# EasyEDA Pro project ProDoc_Sensor_2025-09-14.epro, board SENSOR_PCB
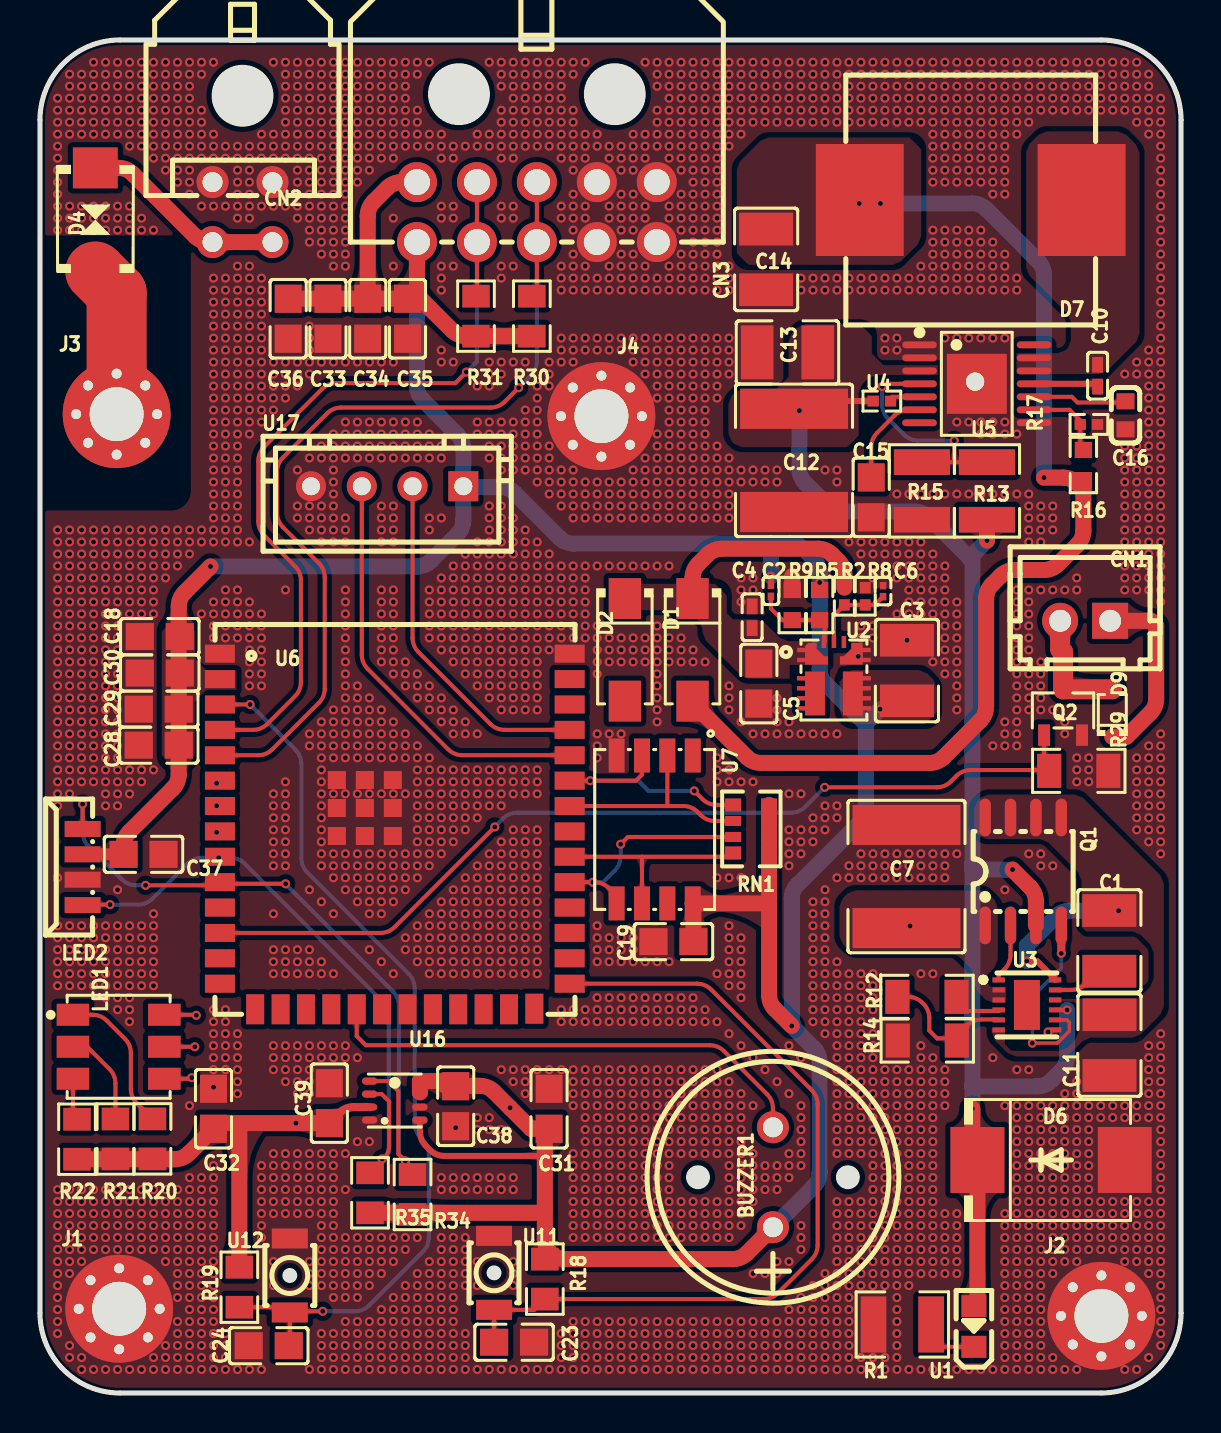
[diagram p1: board, top side]
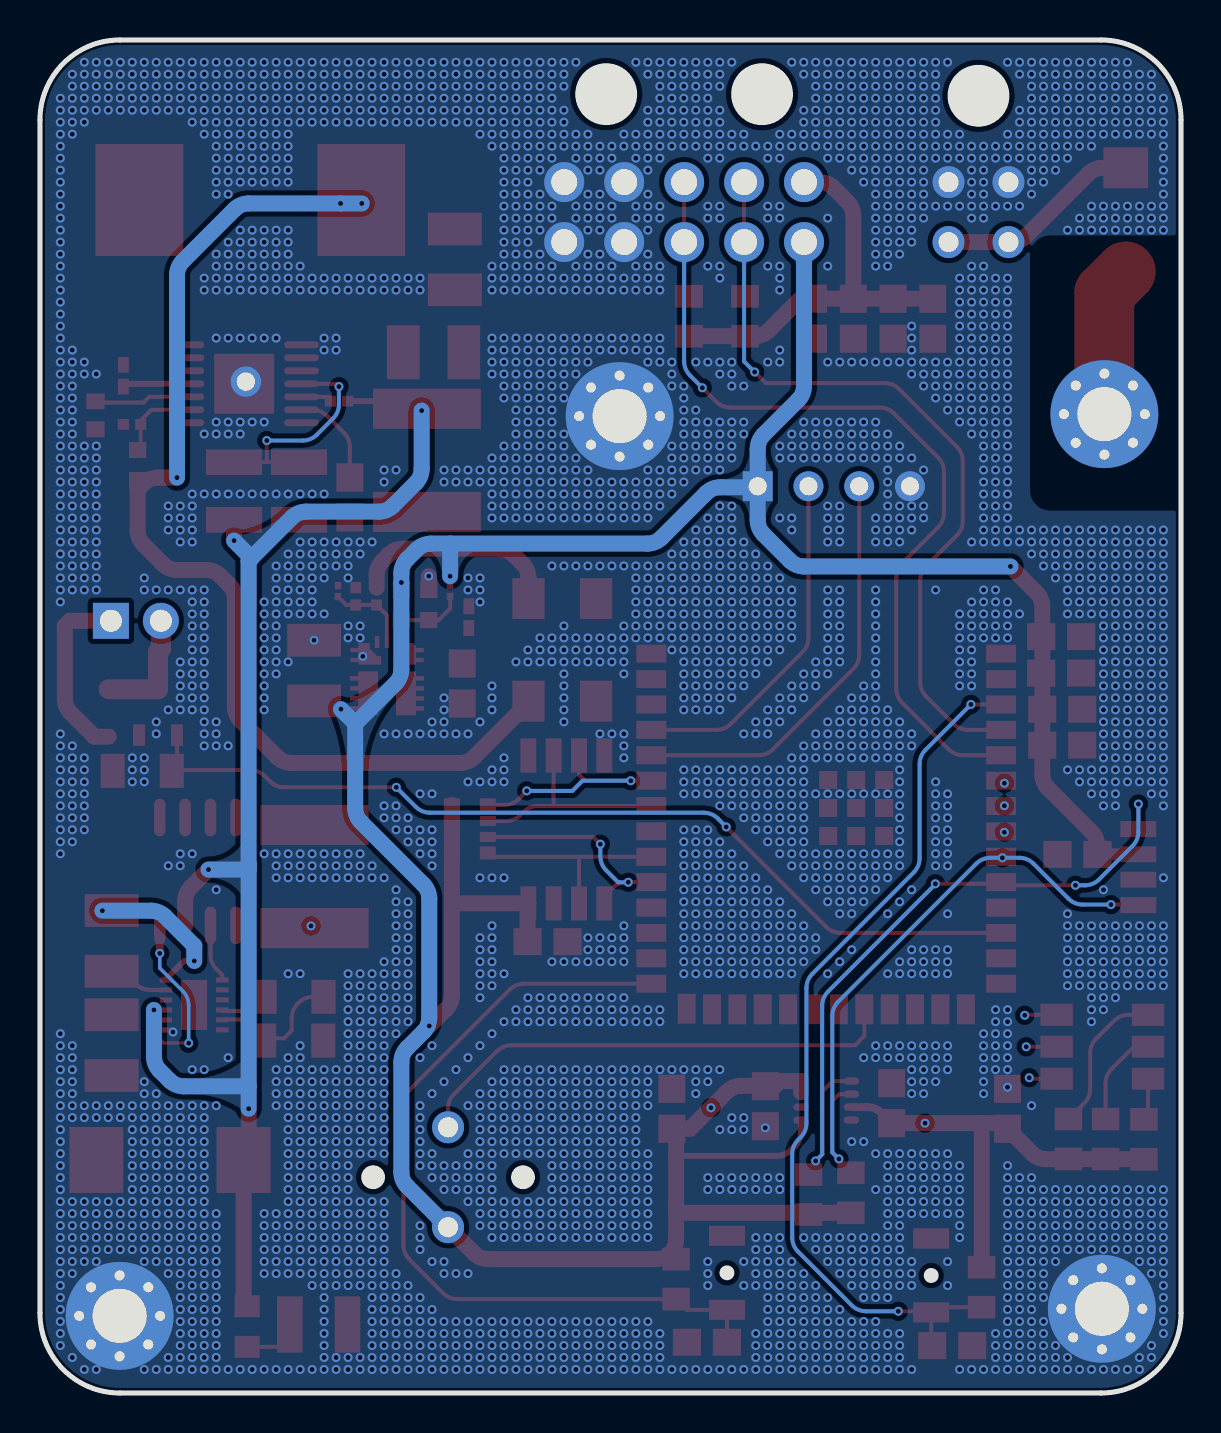
[diagram p2: board, bottom side, seen from below]

Outline 57.1 x 67.69 mm; copper layers: Top Layer, Inner1, Inner2, Bottom Layer. Coordinates in mm from the lower left corner of the outline.
Outline path: 0,63.69 0,4 arc(1.17,1.17) 4,0 53.1,0 arc(55.93,1.17) 57.1,4 57.1,63.69 arc(55.93,66.52) 53.1,67.69 4,67.69 arc(1.17,66.52) 0,63.69
Stack: Top Layer 0.035mm Outer layer thickness 1oz / Dielectric1 0.2104mm 7628 RC49% 8.6mil / Inner1 0.0152mm Inner layer thickness / Dielectric2 1.065mm 1.1mm H/HOZ Copper / Inner2 0.0152mm Inner layer thickness / Dielectric3 0.2104mm 7628 RC49% 8.6mil / Bottom Layer 0.035mm Outer layer thickness 1oz

## Design rules (mm)
template: Custom Config
spacing copperThickness1oz (default): track to track 0.102, other pairs 0.152 to 0.3
spacing copperThickness2oz: track to track 0.203, other pairs 0.152 to 0.3
track width copperThickness1oz (default): min 0.127, default 0.254, max 2.54
track width copperThickness2oz: min 0.203, default 0.254, max 2.54
track width Power: min 0.17, default 0.8, max 8
track width signal: min 0.17, default 0.203, max 8
differential pair differentialPair (default): width min 0.157, default 0.157, max 0.157; gap min 0.203, default 0.203
via viaSize (default): diameter min 0.1, default 0.45, max 10; hole min 0.1, default 0.25, max 6.3
net +3V3 uses Power
net VIN uses Power
net VCC uses Power
net +5V uses Power
net +48V uses Power
net VS uses Power
net SW1 uses Power
net EARTH uses Power
net EN uses signal
net R uses signal
net G uses signal
net B uses signal
net VBUS uses Power
net FAN uses signal
net GND uses Power
net BUZZ uses signal
net BOOT uses signal
net TXD0EP uses signal
net RXD0EP uses signal
net FNMSS uses signal
net SPI_MOSI uses signal
net SPI_MISO uses signal
net SPI_CLK uses signal
net SPI_CS uses signal
net FB3 uses signal
net END uses signal
net SS uses signal
net RON uses signal
net UVLO uses signal
net OV uses signal
net LED uses signal
net SW uses Power
net DGATE uses signal
net FB5 uses signal
net VCA uses signal
net HGATE uses Power
net CAP uses Power
net BST uses Power
net SD_D2 uses signal
net SD_D1 uses signal
net I2C_SDA uses signal
net I2C2_SCL uses signal
net I2C_SCL uses signal
net I2C2_SDA uses signal
net BRESS uses signal
net GRESS uses signal
net RRES uses signal

## Placement (name value [footprint] x y rotation side)
BUZZER1  4kHz  [BUZ-TH_PKM13EPYH4002-B0]  36.68 10.79 90 top
C1  100nF  [C1210]  53.51 22.62 270 top
C2  22pF  [C0201]  36.58 40.13 90 top
C3  47uF  [C1210]  43.38 36.14 270 top
C4  100nF  [C0402]  35.64 38.81 270 top
C5  10uF  [C0805]  35.97 35.49 90 top
C6  10nF  [C0201]  42.19 40.12 270 top
C7  1uF  [C2220]  43.36 25.84 90 top
C10  10nF  [C0402]  52.92 50.9 270 top
C11  100nF  [C1210]  53.52 17.41 90 top
C12  1uF  [C2220]  37.73 46.66 90 top
C13  100nF  [C1210]  37.4 52.06 0 top
C14  100uF  [C1210]  36.34 56.71 90 top
C15  22nF  [C0805]  41.6 44.81 90 top
C16  1uF  [C0603]  54.32 48.91 90 top
C18  100nF  [C0805]  6 37.84 0 top
C19  100nF  [C0805]  31.7 22.58 0 top
C23  100nF  [C0805]  23.72 2.54 0 top
C24  100nF  [C0805]  11.45 2.37 180 top
C28  100nF  [C0805]  5.94 32.41 0 top
C29  100nF  [C0805]  5.94 34.21 0 top
C30  100nF  [C0805]  5.99 36.02 0 top
C31  100nF  [C0805]  25.48 14.22 270 top
C32  100nF  [C0805]  8.68 14.22 270 top
C33  100nF  [C0805]  14.41 53.75 90 top
C34  100nF  [C0805]  16.4 53.75 90 top
C35  100nF  [C0805]  18.39 53.75 90 top
C36  100nF  [C0805]  12.42 53.75 90 top
C37  100nF  [C0805]  5.18 26.95 180 top
C38  100nF  [C0805]  20.8 14.35 90 top
C39  100nF  [C0805]  14.48 14.5 270 top
CN1  ZX-XH2.54-2PZZ  [CONN-TH_2P-P2.50_HX25003-2A]  52.3 38.63 180 top
CN2  430450400  [CONN-TH_0430450400]  10.13 59.08 180 top
CN3  430451000  [CONN-TH_43045-1000]  24.87 59.08 180 top
D1  US1M  [SMA_L4.4-W2.8-LS5.4-RD]  32.65 37.18 270 top
D2  US1M  [SMA_L4.4-W2.8-LS5.4-RD]  29.27 37.18 270 top
D4  SMBJ58CA  [SMB_L4.6-W3.6-LS5.3-BI]  2.77 58.7 90 top
D6  SMCJ58A  [SMC_L6.9-W5.8-LS7.9-RD]  50.6 11.66 0 top
D7  68uH  [IND-SMD_L12.5-W12.5-SRR1280-150M]  46.57 59.68 180 top
D9  BAT46WJ,115  [SOD-323F_L2.0-W1.6-LS2.5-RD]  53.66 34.02 90 top
J1  SCREW-MOUNTING-HOLE-3MM  [MountingHole:MountingHole_2.7mm_M2.5_Pad_Via]  3.96 4.21 0 top
J2  SCREW-MOUNTING-HOLE-3MM  [MountingHole:MountingHole_2.7mm_M2.5_Pad_Via]  53.11 3.86 0 top
J3  SCREW-MOUNTING-HOLE-3MM  [MountingHole:MountingHole_2.7mm_M2.5_Pad_Via]  3.84 48.97 0 top
J4  SCREW-MOUNTING-HOLE-3MM  [MountingHole:MountingHole_2.7mm_M2.5_Pad_Via]  28.09 48.87 0 top
LED1  HL-AF-5060H271BU46FU79GC-S1-THL  [LED-ARRAY-SMD_6P-L5.4-W5.0-TL-FD]  3.94 17.32 0 top
LED2  VEML7700-TR  [LED-SMD_4P-L6.8-W2.4_VEML7700-TR]  2.13 26.31 90 top
NOREF  -  [Pad_e167]  46.79 50.6 0 top
Q1  FDS3992  [SO-8_L4.9-W3.9-P1.27-LS5.9-BL]  49.2 26.09 0 top
Q2  AO3400A  [SOT-23-3_L2.9-W1.6-P1.90-LS2.8-BR]  51.19 34.15 270 top
R1  22kΩ  [R1210]  43.15 3.43 0 top
R2  22.1kΩ  [R0402]  40.25 39.86 90 top
R5  135kΩ  [R0603]  39.01 39.42 90 top
R8  10kΩ  [R0402]  41.3 39.86 270 top
R9  30kΩ  [R0603]  37.64 39.42 270 top
R12  105kΩ  [R1206]  44.39 19.82 0 top
R13  75kΩ  [R1210]  47.39 45.13 270 top
R14  2.21kΩ  [R1206]  44.4 17.63 0 top
R15  2.8kΩ  [R1210]  44.14 45.13 90 top
R16  3kΩ  [R0603]  52.21 46.43 270 top
R17  2kΩ  [R0402]  52.49 48.46 180 top
R18  10kΩ  [R0805]  25.26 5.7 270 top
R19  10kΩ  [R0805]  9.98 5.29 270 top
R20  300Ω  [R0805]  1.85 12.7 270 top
R21  300Ω  [R0805]  3.78 12.71 270 top
R22  300Ω  [R0805]  5.63 12.71 270 top
R29  68kΩ  [R1206]  51.98 31.13 0 top
R30  2.2kΩ  [R0805]  24.61 53.87 270 top
R31  2.2kΩ  [R0805]  21.82 53.87 270 top
R34  4.7kΩ  [R0805]  18.64 9.93 270 top
R35  4.7kΩ  [R0805]  16.52 10.02 270 top
RN1  10kΩ  [RES-ARRAY-SMD_0603-8P-L3.2-W1.6-BL]  35.59 28.22 270 top
U1  APT2012LZGCK  [LED-SMD_L2.0-W1.3-R-RD]  46.73 3.33 90 top
U2  TPSM863252RDXR  [QFN-7_L4.0-W3.3_TPSM863257RDXR]  39.73 36.28 0 top
U3  LM74800QDRRRQ1  [WSON-12_L3.0-W3.0-P0.50-TL-EP-2]  49.39 19.42 0 top
U4  261kΩ  [R0402]  42.13 49.63 180 top
U5  LM5161PWPR  [HTSSOP-14_L5.0-W4.4-P0.65-LS6.4-BL-EP3.0]  46.88 50.49 270 top
U6  ESP32-S3-WROOM-1U-N8R8  [WIRELM-SMD_ESP32-S3-WROOM-1U]  17.75 28.09 0 top
U7  MKDV8GIL-AST  [LGA-8_L6.0-W8.0-P1.27-TL]  30.76 28.19 270 top
U11  TD-1183SN-1.7H-250  [KEY-SMD_L3.0-W2.5-LS4.0]  22.72 6.01 90 top
U12  TD-1183SN-1.7H-250  [KEY-SMD_L3.0-W2.5-LS4.0]  12.5 5.88 90 top
U16  BME280  [LGA-8_BME280_BL]  17.75 14.63 180 top
U17  ZX-XH2.54-4PZZ-Y  [CONN-TH_4P-P2.50_ZX-XH2.54-4PZZ-Y]  17.37 45.36 0 top

## Footprints (pads in the part's own frame, mm; a bottom-side part is the same pattern mirrored in y, then rotated)
BUZ-TH_PKM13EPYH4002-B0
  round 1.6 hole 1: 1(-2.5,0) 2(2.5,0)
C0201
  rect 0.368x0.324 smd: 1(-0.275,0) 2(0.275,0)
C0402
  rect 0.79x0.54 smd: 1(-0.545,0) 2(0.545,0)
C0603
  rect 0.8x0.9 smd: 1(-0.7,0) 2(0.7,0)
C0805
  rect 1.41x1.35 smd: 1(-1,0) 2(1,0)
C1210
  rect 1.635x2.7 smd: 1(-1.518,0) 2(1.518,0)
C2220
  rect 2.01x5.4 smd: 1(-2.58,0) 2(2.58,0)
CONN-TH_2P-P2.50_HX25003-2A
  rect 1.8x1.8 hole 1.1: 1(-1.25,0)
  round 1.8 hole 1.1: 2(1.25,0)
CONN-TH_4P-P2.50_ZX-XH2.54-4PZZ-Y
  rect 1.5x1.5 hole 0.9: 1(3.81,0)
  round 1.5 hole 0.9: 2(1.27,0) 3(-1.27,0) 4(-3.81,0)
CONN-TH_43045-1000
  round 2 hole 1.3: 1(6.001,-1.5) 2(3.001,-1.5) 3(0.002,-1.5) 4(-2.998,-1.5) 5(-5.998,-1.5) 6(6.001,1.5) 7(3.001,1.5) 8(0.002,1.5) 9(-2.998,1.5) 10(-6.001,1.5)
CONN-TH_0430450400
  round 1.6 hole 1: 1(1.5,-1.5) 2(-1.5,-1.5) 3(1.5,1.5) 4(-1.5,1.5)
HTSSOP-14_L5.0-W4.4-P0.65-LS6.4-BL-EP3.0
  oval 0.343x1.732 smd: 1(-1.95,-2.866) 2(-1.3,-2.866) 3(-0.65,-2.866) 4(0,-2.866) 5(0.65,-2.866) 6(1.3,-2.866) 7(1.95,-2.866) 8(1.95,2.866) 9(1.3,2.866) 10(0.65,2.866) 11(0,2.866) 12(-0.65,2.866) 13(-1.3,2.866) 14(-1.95,2.866)
  rect 3x3 smd: 15(0,0)
IND-SMD_L12.5-W12.5-SRR1280-150M
  rect 4.4x5.6 smd: 1(-5.55,0) 2(5.55,0)
KEY-SMD_L3.0-W2.5-LS4.0
  rect 1x1.8 smd: 1(-1.85,0) 2(1.85,0)
LED-ARRAY-SMD_6P-L5.4-W5.0-TL-FD
  rect 1.625x1.1 smd: 1(-2.288,1.6) 2(-2.288,0) 3(-2.288,-1.6) 4(2.288,-1.6) 5(2.288,0) 6(2.288,1.6)
LED-SMD_4P-L6.8-W2.4_VEML7700-TR
  rect 0.8x1.8 smd: 1(1.905,0) 2(0.635,0) 3(-0.635,0) 4(-1.905,0)
LED-SMD_L2.0-W1.3-R-RD
  rect 1.1x1.25 smd: 1(1.016,0) 2(-1.016,0)
LGA-8_BME280_BL
  oval 0.767x0.364 smd: 1(1.258,0.975) 2(1.258,0.325) 3(1.258,-0.325) 4(1.258,-0.975) 5(-1.258,-0.975) 6(-1.258,-0.325) 7(-1.258,0.325) 8(-1.258,0.975)
LGA-8_L6.0-W8.0-P1.27-TL
  rect 1.7x0.8 smd: 1(-3.7,1.905) 2(-3.7,0.635) 3(-3.7,-0.635) 4(-3.7,-1.905) 5(3.7,-1.905) 6(3.7,-0.635) 7(3.7,0.635) 8(3.7,1.905)
MountingHole:MountingHole_2.7mm_M2.5_Pad_Via
  round 0.8 hole 0.5: 1(-2.025,0) 1(-1.432,1.432) 1(-1.432,-1.432) 1(0,2.025) 1(0,-2.025) 1(1.432,1.432) 1(1.432,-1.432) 1(2.025,0)
  round 5.4 hole 2.7: 1(0,0)
Pad_e167
  round 1.524 hole 0.914: 1(0,0)
QFN-7_L4.0-W3.3_TPSM863257RDXR
  custom 1.54x1.08 smd: 1(-0.975,0.697) 4(0.975,0.697)
  custom 1.4x2.195 smd: 2(-1.05,-1.286) 3(1.05,-1.286)
  rect 0.22x0.6 smd: 5(0.5,1.286) 6(0,1.286) 7(-0.5,1.286)
R0402
  rect 0.566x0.54 smd: 1(-0.433,0) 2(0.433,0)
R0603
  rect 0.806x0.864 smd: 1(-0.753,0) 2(0.753,0)
R0805
  rect 1.133x1.377 smd: 1(-1,0) 2(1,0)
R1206
  rect 1.208x1.701 smd: 1(-1.479,0) 2(1.479,0)
R1210
  rect 1.282x2.808 smd: 1(-1.441,0) 2(1.441,0)
RES-ARRAY-SMD_0603-8P-L3.2-W1.6-BL
  rect 0.65x0.8 smd: 1(-1.2,-0.9) 4(1.2,-0.9) 5(1.2,0.9) 8(-1.2,0.9)
  rect 0.5x0.8 smd: 2(-0.4,-0.9) 3(0.4,-0.9) 6(0.4,0.9) 7(-0.4,0.9)
SMA_L4.4-W2.8-LS5.4-RD
  rect 2.046x1.62 smd: 1(-2.566,0) 2(2.566,0)
SMB_L4.6-W3.6-LS5.3-BI
  rect 2.047x2.241 smd: 1(-2.591,0) 2(2.591,0)
SMC_L6.9-W5.8-LS7.9-RD
  rect 2.7x3.3 smd: 1(-3.687,0) 2(3.687,0)
SO-8_L4.9-W3.9-P1.27-LS5.9-BL
  oval 0.574x1.888 smd: 1(-1.905,-2.699) 2(-0.635,-2.699) 3(0.635,-2.699) 4(1.905,-2.699) 5(1.905,2.699) 6(0.635,2.699) 7(-0.635,2.699) 8(-1.905,2.699)
SOD-323F_L2.0-W1.6-LS2.5-RD
  rect 0.73x0.385 smd: 1(-1.185,0) 2(1.185,0)
SOT-23-3_L2.9-W1.6-P1.90-LS2.8-BR
  rect 1.07x0.6 smd: 1(1.235,-0.95) 2(1.235,0.95) 3(-1.235,0)
WIRELM-SMD_ESP32-S3-WROOM-1U
  rect 1.5x0.9 smd: 1(-8.75,8.895) 2(-8.75,7.625) 3(-8.75,6.355) 4(-8.75,5.085) 5(-8.75,3.815) 6(-8.75,2.545) 7(-8.75,1.275) 8(-8.75,0.005) 9(-8.75,-1.265) 10(-8.75,-2.535) 11(-8.75,-3.805) 12(-8.75,-5.075) 13(-8.75,-6.345) 14(-8.75,-7.615) 27(8.75,-7.615) 28(8.75,-6.345) 29(8.75,-5.075) 30(8.75,-3.805) 31(8.75,-2.535) 32(8.75,-1.265) 33(8.75,0.005) 34(8.75,1.275) 35(8.75,2.545) 36(8.75,3.815) 37(8.75,5.085) 38(8.75,6.355) 39(8.75,7.625) 40(8.75,8.895)
  rect 0.9x1.5 smd: 15(-6.985,-8.895) 16(-5.715,-8.895) 17(-4.445,-8.895) 18(-3.175,-8.895) 19(-1.905,-8.895) 20(-0.635,-8.895) 21(0.635,-8.895) 22(1.905,-8.895) 23(3.175,-8.895) 24(4.445,-8.895) 25(5.715,-8.895) 26(6.985,-8.865)
  rect 0.9x0.9 smd: 41(-2.9,2.575) 41(-2.9,1.175) 41(-2.9,-0.225) 41(-1.5,2.575) 41(-1.5,1.175) 41(-1.5,-0.225) 41(-0.1,2.575) 41(-0.1,1.175) 41(-0.1,-0.225)
WSON-12_L3.0-W3.0-P0.50-TL-EP-2
  rect 0.623x0.25 smd: 1(-1.411,1.25) 2(-1.411,0.75) 3(-1.411,0.25) 4(-1.411,-0.25) 5(-1.411,-0.75) 6(-1.411,-1.25) 7(1.411,-1.25) 8(1.411,-0.75) 9(1.411,-0.25) 10(1.411,0.25) 11(1.411,0.75) 12(1.411,1.25)
  rect 1.3x2.5 smd: 13(0,0)

## Nets
As in the schematic, except:
GND: C3.1 C4.1 C5.1 C6.1 C7.2 C11.1 C12.1 C13.1 C14.1 C15.1 C16.1 C18.1 C19.1 C23.2 C24.2 C28.1 C29.1 C30.1 C31.1 C32.1 C33.1 C34.1 C35.1 C36.1 C37.1 C38.1 C39.1 CN2.1 CN2.2 CN3.4 CN3.5 CN3.9 CN3.10 D6.2 J1.1 J2.1 J4.1 LED2.3 NOREF.1 Q2.2 R1.1 R8.1 R9.1 R14.1 R15.1 R17.1 R29.2 U2.4 U3.7 U5.1 U5.2 U5.8 U5.15 U6.1 U6.40 U6.41 U7.4 U11.2 U12.2 U16.1 U16.7 U17.4

Pads without a net: U2 2 5; U3 13; U5 7 14; U6 11 13 14 15 16 17 18 20 21 22 23 24 25 26 28 29 30 33 38 39

## Via types
v1: diameter 0.45, hole 0.25, Top Layer to Bottom Layer, 3879 vias

## Routing (per net, layer and track width the routed paths; a pad name or vN(x,y) marks a point on that pad's centre or on a via; arc(x,y) is an arc through that point)
+3V3: length 255.4
  Top Layer w0.25: C2.2 v1(36.58,40.86)
  Top Layer w0.3: U16.8 19.01,13.07 arc(19.09,12.69) 19.31,12.37 19.52,12.15 arc(19.84,11.94) 20.23,11.86 25.11,11.86 25.26,11.71
  Top Layer w0.4: 14.77,13.79 14.99,14.01 arc(15.32,14.23) 15.7,14.31 U16.2
  Top Layer w0.6: LED2.2 C37.2
  Top Layer w0.8: 18.87,55.22 18.87,54.92 20.62,53.17 arc(20.94,52.95) 21.33,52.87 R31.2 R30.2 ; 18.87,55.22 C35.2 C34.2 ; 18.87,55.22 CN3.6 ; 25.17,13.49 25.26,13.4 25.26,9.24 ; C34.2 C33.2 C36.2 ; C34.2 16.4,58.89 arc(16.48,59.27) 16.69,59.6 17.38,60.29 arc(17.71,60.5) 18.09,60.58 CN3.1 ; v1(8.53,41.35) 7.24,40.05 arc(7.02,39.73) 6.94,39.35 C29.2 C28.2 6.94,30.95 arc(6.87,30.57) 6.65,30.25 4.47,28.07 arc(4.26,27.75) 4.18,27.36 C37.2 ; 20.29,15.61 19.01,15.61 19.01,15.04 ; R20.2 6.74,11.7 arc(7.13,11.77) 7.45,11.99 C32.2 8.96,13.5 9.93,13.5 ; R19.1 9.98,13.45 9.93,13.5 ; 36.49,24.49 RN1.5 RN1.6 RN1.7 RN1.8 ; 36.49,24.49 U7.8 32.7,24.46 C19.2 ; 36.49,24.49 36.49,19.91 arc(36.56,19.53) 36.78,19.2 v1(37.62,18.36) ; 25.26,9.24 25.04,9.02 R35.2 ; 25.26,9.24 25.26,7.7 arc(25.56,6.99) 26.26,6.7 34.67,6.7 arc(35.05,6.78) 35.37,6.99 BUZZER1.1 ; 9.93,13.5 v1(12.81,13.5) 14.07,13.5 arc(14.45,13.58) 14.77,13.79 ; 20.29,15.37 22.01,15.37 arc(22.4,15.29) 22.72,15.07 v1(23.52,14.27) 24.57,13.22 25.17,13.22
  Inner2 w0.8: v1(23.52,14.27) 22.57,15.23 arc(22.24,15.44) 21.86,15.52 19.46,15.52 arc(19.08,15.44) 18.76,15.23 17.32,13.79 arc(17,13.58) 16.62,13.5 13.22,13.5 arc(13.03,13.52) 12.84,13.58 arc(12.67,13.67) 12.52,13.79 11.16,15.15 arc(10.95,15.47) 10.87,15.85 10.87,30.14 arc(10.95,30.52) 11.16,30.85 12.15,31.84 arc(12.37,32.16) 12.45,32.55 12.45,38.5 arc(12.37,38.88) 12.15,39.21 10.3,41.06 arc(9.98,41.28) 9.59,41.35 v1(8.53,41.35)
  Bottom Layer w0.8: 41.31,33.49 41.33,33.48 41.33,29.27 arc(41.25,28.89) 41.03,28.56 37.91,25.44 arc(37.69,25.11) 37.62,24.73 37.62,18.78 arc(37.64,18.58) 37.69,18.4 arc(37.79,18.22) 37.91,18.07 38.72,17.26 arc(38.94,16.94) 39.01,16.55 39.01,11.05 arc(38.94,10.66) 38.72,10.34 BUZZER1.1 ; 41.31,33.49 39.31,35.5 arc(39.09,35.82) 39.01,36.2 v1(39.01,40.55) 39.01,41.01 arc(38.94,41.4) 38.72,41.72 38.24,42.2 arc(37.92,42.42) 37.53,42.49 36.55,42.49 ; 41.31,33.49 v1(42.04,34.21) ; 21.18,45.8 U17.1 21.18,43.67 arc(21.11,43.29) 20.89,42.96 19.57,41.64 arc(19.25,41.43) 18.86,41.35 v1(8.53,41.35) ; 21.18,45.8 21.18,47.24 arc(21.11,47.62) 20.89,47.94 19.16,49.68 arc(18.94,50) 18.87,50.38 CN3.6 ; 21.18,45.8 21.67,45.31 23.06,45.31 arc(23.44,45.24) 23.76,45.02 26,42.79 arc(26.32,42.57) 26.7,42.49 36.55,42.49 ; v1(36.58,40.86) 36.58,42.47 36.55,42.49
+5V: length 55
  Top Layer w0.8: D1.2 32.65,34.53 35.37,31.81 arc(35.69,31.6) 36.08,31.52 44.52,31.52 arc(44.9,31.6) 45.23,31.81 47.05,33.64 arc(47.27,33.97) 47.35,34.35 47.35,39.74 arc(47.42,40.13) 47.64,40.45 48.07,40.88 arc(48.39,41.1) 48.78,41.17 50.23,41.17 arc(50.62,41.25) 50.94,41.47 51.92,42.44 arc(52.14,42.77) 52.21,43.15 52.21,45.2 ; R16.2 52.21,45.2 ; 52.21,45.2 51.91,45.5 arc(51.58,45.72) 51.2,45.8 v1(50.24,45.8)
  Bottom Layer w0.8: v1(41,59.51) v1(42.06,59.51) 46.65,59.51 arc(47.03,59.44) 47.36,59.22 49.95,56.63 arc(50.16,56.31) 50.24,55.92 v1(50.24,45.8)
+48V: length 71.4
  Top Layer w0.21: U3.9 v1(51.4,19.17)
  Top Layer w0.3: U4.2 38.12,49.63 C12.2
  Top Layer w0.8: U1.1 46.91,4.52 D6.1 46.66,11.91 v1(46.66,14.22) ; Q1.3 49.84,24.6 arc(49.76,24.99) 49.54,25.31 v1(48.67,26.19) ; R13.2 v1(47.39,42.65)
  Bottom Layer w0.8: 46.66,26.46 46.66,41.63 46.52,41.78 ; 46.66,26.46 46.66,26.46 46.66,15.34 ; 46.66,26.46 46.66,26.19 v1(48.67,26.19) ; v1(38,49.15) 38,46.24 arc(38.07,45.85) 38.29,45.53 39.43,44.39 arc(39.76,44.17) 40.14,44.09 43.78,44.09 arc(44.16,44.02) 44.49,43.8 46.52,41.78 ; 46.52,41.78 v1(47.39,42.65) ; v1(51.4,19.17) 51.4,16.83 arc(51.32,16.45) 51.1,16.13 50.61,15.64 arc(50.29,15.42) 49.91,15.34 46.66,15.34 ; 46.66,15.34 v1(46.66,14.22)
GND: length 0.7
  Top Layer w0.8: R9.1 v1(37.64,40.87)
  vias: v1(0.88,64.78) v1(0.88,64.18) v1(0.88,63.58) v1(0.88,62.98) v1(0.88,62.38) v1(0.88,61.78) v1(0.88,61.18) v1(0.88,60.58) v1(0.88,59.98) v1(0.88,59.38) v1(0.88,58.78) v1(0.88,58.18) v1(0.88,43.18) v1(0.88,42.58) v1(0.88,41.98) v1(0.88,41.38) v1(0.88,40.78) v1(0.88,40.18) v1(0.88,39.58) v1(0.88,38.98) v1(0.88,38.38) v1(0.88,37.78) v1(0.88,37.18) v1(0.88,36.58) v1(0.88,35.98) v1(0.88,35.38) v1(0.88,34.78) v1(0.88,34.18) v1(0.88,33.58) v1(0.88,32.98) v1(0.88,32.38) v1(0.88,31.78) v1(0.88,31.18) v1(0.88,30.58) v1(0.88,29.98) v1(0.88,29.38) v1(0.88,25.78) v1(0.88,23.38) v1(0.88,22.78) v1(0.88,22.18) v1(0.88,21.58) v1(0.88,20.98) v1(0.88,20.38) v1(0.88,10.18) v1(0.88,9.58) v1(0.88,8.98) v1(0.88,8.38) v1(0.88,7.78) v1(0.88,7.18) v1(0.88,6.58) v1(0.88,5.98) v1(0.88,5.38) v1(0.88,4.78) v1(0.88,4.18) v1(0.88,3.58) v1(0.88,2.98) v1(1.48,65.98) v1(1.48,65.38) v1(1.48,64.78) v1(1.48,64.18) v1(1.48,63.58) v1(1.48,62.98) v1(1.48,59.38) v1(1.48,58.78) v1(1.48,58.18) v1(1.48,43.18) v1(1.48,42.58) v1(1.48,41.98) v1(1.48,41.38) v1(1.48,40.78) v1(1.48,40.18) v1(1.48,39.58) v1(1.48,38.98) v1(1.48,38.38) v1(1.48,37.78) v1(1.48,37.18) v1(1.48,36.58) v1(1.48,35.98) v1(1.48,35.38) v1(1.48,34.78) v1(1.48,34.18) v1(1.48,33.58) v1(1.48,32.98) v1(1.48,32.38) v1(1.48,31.78) v1(1.48,31.18) v1(1.48,30.58) v1(1.48,29.98) v1(1.48,23.38) v1(1.48,22.78) v1(1.48,22.18) v1(1.48,21.58) v1(1.48,20.98) v1(1.48,20.38) v1(1.48,10.18) v1(1.48,9.58) v1(1.48,8.98) v1(1.48,8.38) v1(1.48,7.78) v1(1.48,7.18) v1(1.48,6.58) v1(1.48,5.98) v1(1.48,2.38) v1(1.48,1.78) v1(2.08,65.98) v1(2.08,65.38) v1(2.08,64.78) v1(2.08,64.18) v1(2.08,63.58) v1(2.08,62.98) v1(2.08,59.38) v1(2.08,58.78) v1(2.08,58.18) v1(2.08,43.18) v1(2.08,42.58) v1(2.08,41.98) v1(2.08,41.38) v1(2.08,40.78) v1(2.08,40.18) v1(2.08,39.58) v1(2.08,38.98) v1(2.08,38.38) v1(2.08,37.78) v1(2.08,37.18) v1(2.08,36.58) v1(2.08,35.98) v1(2.08,35.38) v1(2.08,34.78) v1(2.08,34.18) v1(2.08,33.58) v1(2.08,32.98) v1(2.08,32.38) v1(2.08,31.78) v1(2.08,31.18) v1(2.08,30.58) v1(2.08,23.38) v1(2.08,22.78) v1(2.08,22.18) v1(2.08,21.58) v1(2.08,20.98) v1(2.08,20.38) v1(2.08,10.18) v1(2.08,9.58) v1(2.08,8.98) v1(2.08,8.38) v1(2.08,7.78) v1(2.08,7.18) v1(2.08,6.58) v1(2.08,1.78) v1(2.08,1.18) v1(2.68,66.58) v1(2.68,65.98) v1(2.68,65.38) v1(2.68,64.78) v1(2.68,64.18) v1(2.68,63.58) v1(2.68,62.98) v1(2.68,59.38) v1(2.68,58.78) v1(2.68,58.18) v1(2.68,43.18) v1(2.68,42.58) v1(2.68,41.98) v1(2.68,41.38) v1(2.68,40.78) v1(2.68,40.18) v1(2.68,39.58) v1(2.68,38.98) v1(2.68,38.38) v1(2.68,37.78) v1(2.68,37.18) v1(2.68,36.58) v1(2.68,35.98) v1(2.68,35.38) v1(2.68,34.78) v1(2.68,34.18) v1(2.68,33.58) v1(2.68,32.98) v1(2.68,32.38) v1(2.68,31.78) v1(2.68,31.18) v1(2.68,30.58) v1(2.68,23.38) v1(2.68,22.78) v1(2.68,22.18) v1(2.68,21.58) v1(2.68,20.98) v1(2.68,20.38) v1(2.68,10.18) v1(2.68,9.58) v1(2.68,8.98) v1(2.68,8.38) v1(2.68,7.78) v1(2.68,7.18) v1(2.68,1.18) v1(3.28,66.58) v1(3.28,65.98) v1(3.28,65.38) v1(3.28,64.78) v1(3.28,64.18) v1(3.28,63.58) v1(3.28,62.98) v1(3.28,59.38) v1(3.28,58.78) v1(3.28,58.18) v1(3.28,43.18) v1(3.28,42.58) v1(3.28,41.98) v1(3.28,41.38) v1(3.28,40.78) v1(3.28,40.18) v1(3.28,39.58) v1(3.28,38.98) v1(3.28,38.38) v1(3.28,37.78) v1(3.28,37.18) v1(3.28,36.58) v1(3.28,35.98) v1(3.28,35.38) v1(3.28,34.78) v1(3.28,34.18) v1(3.28,33.58) v1(3.28,32.98) v1(3.28,32.38) v1(3.28,31.78) v1(3.28,31.18) v1(3.28,30.58) v1(3.28,29.98) v1(3.28,29.38) v1(3.28,23.38) v1(3.28,22.78) v1(3.28,22.18) v1(3.28,21.58) v1(3.28,20.98) v1(3.28,20.38) v1(3.28,19.78) v1(3.28,10.18) v1(3.28,9.58) v1(3.28,8.98) v1(3.28,8.38) v1(3.28,7.78) v1(3.28,7.18) v1(3.28,1.18) v1(3.88,66.58) v1(3.88,65.98) v1(3.88,65.38) v1(3.88,64.78) v1(3.88,64.18) v1(3.88,63.58) v1(3.88,62.98) v1(3.88,59.38) v1(3.88,58.78) v1(3.88,58.18) v1(3.88,43.18) v1(3.88,42.58) v1(3.88,41.98) v1(3.88,41.38) v1(3.88,40.78) v1(3.88,40.18) v1(3.88,39.58) v1(3.88,38.98) v1(3.88,38.38) v1(3.88,37.78) v1(3.88,37.18) v1(3.88,36.58) v1(3.88,35.98) v1(3.88,35.38) v1(3.88,34.78) v1(3.88,34.18) v1(3.88,33.58) v1(3.88,32.98) v1(3.88,32.38) v1(3.88,31.78) v1(3.88,31.18) v1(3.88,30.58) v1(3.88,29.98) v1(3.88,29.38) v1(3.88,25.18) v1(3.88,23.38) v1(3.88,22.78) v1(3.88,22.18) v1(3.88,21.58) v1(3.88,20.98) v1(3.88,20.38) v1(3.88,19.78) v1(3.88,19.18) v1(3.88,10.18) v1(3.88,9.58) v1(3.88,8.98) v1(3.88,8.38) v1(3.88,7.78) v1(3.88,7.18) v1(3.88,1.18) v1(4.48,66.58) v1(4.48,65.98) v1(4.48,65.38) v1(4.48,64.78) v1(4.48,64.18) v1(4.48,63.58) v1(4.48,62.98) v1(4.48,62.38) v1(4.48,59.38) v1(4.48,58.78) v1(4.48,58.18) v1(4.48,43.18) v1(4.48,42.58) v1(4.48,41.98) v1(4.48,41.38) v1(4.48,40.78) v1(4.48,40.18) v1(4.48,39.58) v1(4.48,38.98) v1(4.48,31.18) v1(4.48,30.58) v1(4.48,29.98) v1(4.48,23.38) v1(4.48,22.78) v1(4.48,22.18) v1(4.48,21.58) v1(4.48,20.98) v1(4.48,20.38) v1(4.48,19.78) v1(4.48,19.18) v1(4.48,18.58) v1(4.48,10.18) v1(4.48,9.58) v1(4.48,8.98) v1(4.48,8.38) v1(4.48,7.78) v1(4.48,7.18) v1(4.48,1.18) v1(5.08,66.58) v1(5.08,65.98) v1(5.08,65.38) v1(5.08,64.78) v1(5.08,64.18) v1(5.08,63.58) v1(5.08,62.98) v1(5.08,62.38) v1(5.08,58.78) v1(5.08,58.18) v1(5.08,43.18) v1(5.08,42.58) v1(5.08,41.98) v1(5.08,41.38) v1(5.08,40.78) v1(5.08,40.18) v1(5.08,39.58) v1(5.08,38.98) v1(5.08,31.18) v1(5.08,30.58) v1(5.08,23.38) v1(5.08,22.78) v1(5.08,22.18) v1(5.08,21.58) v1(5.08,20.98) v1(5.08,20.38) v1(5.08,10.18) v1(5.08,9.58) v1(5.08,8.98) v1(5.08,8.38) v1(5.08,7.78) v1(5.08,7.18) v1(5.08,1.18) v1(5.68,66.58) v1(5.68,65.98) v1(5.68,65.38) v1(5.68,64.78) v1(5.68,64.18) v1(5.68,63.58) v1(5.68,62.98) v1(5.68,62.38) v1(5.68,61.78) v1(5.68,58.18) v1(5.68,43.18) v1(5.68,42.58) v1(5.68,41.98) v1(5.68,41.38) v1(5.68,40.78) v1(5.68,40.18) v1(5.68,39.58) v1(5.68,38.98) v1(5.68,31.18) v1(5.68,23.98) v1(5.68,23.38) v1(5.68,22.78) v1(5.68,22.18) v1(5.68,21.58) v1(5.68,20.98) v1(5.68,20.38) v1(5.68,10.18) v1(5.68,9.58) v1(5.68,8.98) v1(5.68,8.38) v1(5.68,7.78) v1(5.68,7.18) v1(5.68,1.78) v1(5.68,1.18) v1(6.28,66.58) v1(6.28,65.98) v1(6.28,65.38) v1(6.28,64.78) v1(6.28,64.18) v1(6.28,63.58) v1(6.28,62.98) v1(6.28,62.38) v1(6.28,61.78) v1(6.28,61.18) v1(6.28,43.18) v1(6.28,42.58) v1(6.28,41.98) v1(6.28,41.38) v1(6.28,40.78) v1(6.28,10.18) v1(6.28,9.58) v1(6.28,8.98) v1(6.28,8.38) v1(6.28,7.78) v1(6.28,7.18) v1(6.28,6.58) v1(6.28,2.38) v1(6.28,1.78) v1(6.28,1.18) v1(6.88,66.58) v1(6.88,65.98) v1(6.88,65.38) v1(6.88,64.78) v1(6.88,64.18) v1(6.88,63.58) v1(6.88,62.98) v1(6.88,62.38) v1(6.88,61.78) v1(6.88,61.18) v1(6.88,60.58) v1(6.88,43.18) v1(6.88,42.58) v1(6.88,41.98) v1(6.88,41.38) v1(6.88,10.18) v1(6.88,9.58) v1(6.88,8.98) v1(6.88,8.38) v1(6.88,7.78) v1(6.88,7.18) v1(6.88,6.58) v1(6.88,5.98) v1(6.88,5.38) v1(6.88,4.78) v1(6.88,3.58) v1(6.88,2.98) v1(6.88,2.38) v1(6.88,1.78) v1(6.88,1.18) v1(7.48,66.58) v1(7.48,65.98) v1(7.48,65.38) v1(7.48,64.78) v1(7.48,64.18) v1(7.48,63.58) v1(7.48,62.98) v1(7.48,62.38) v1(7.48,61.78) v1(7.48,61.18) v1(7.48,60.58) v1(7.48,59.98) v1(7.48,43.18) v1(7.48,42.58) v1(7.48,41.98) v1(7.48,14.38) v1(7.48,10.78) v1(7.48,10.18) v1(7.48,9.58) v1(7.48,8.98) v1(7.48,8.38) v1(7.48,7.78) v1(7.48,7.18) v1(7.48,6.58) v1(7.48,5.98) v1(7.48,5.38) v1(7.48,4.78) v1(7.48,4.18) v1(7.48,3.58) v1(7.48,2.98) v1(7.48,2.38) v1(7.48,1.78) v1(7.48,1.18) v1(8.08,66.58) v1(8.08,65.98) v1(8.08,64.18) v1(8.08,63.58) v1(8.08,62.98) v1(8.08,62.38) v1(8.08,61.78) v1(8.08,59.38) v1(8.08,43.18) v1(8.08,42.58) v1(8.08,38.98) v1(8.08,10.78) v1(8.08,10.18) v1(8.08,9.58) v1(8.08,8.98) v1(8.08,8.38) v1(8.08,7.78) v1(8.08,7.18) v1(8.08,6.58) v1(8.08,5.98) v1(8.08,5.38) v1(8.08,4.78) v1(8.08,4.18) v1(8.08,3.58) v1(8.08,2.98) v1(8.08,2.38) v1(8.08,1.78) v1(8.08,1.18) v1(8.68,66.58) v1(8.68,62.98) v1(8.68,62.38) v1(8.68,61.78) v1(8.68,59.38) v1(8.68,55.78) v1(8.68,55.18) v1(8.68,54.58) v1(8.68,53.98) v1(8.68,53.38) v1(8.68,52.78) v1(8.68,52.18) v1(8.68,51.58) v1(8.68,50.98) v1(8.68,50.38) v1(8.68,49.78) v1(8.68,49.18) v1(8.68,48.58) v1(8.68,47.98) v1(8.68,47.38) v1(8.68,46.78) v1(8.68,46.18) v1(8.68,45.58) v1(8.68,44.98) v1(8.68,44.38) v1(8.68,43.78) v1(8.68,43.18) v1(8.68,42.58) v1(8.68,39.58) v1(8.68,38.98) v1(8.68,38.38) v1(8.68,37.78) v1(8.68,19.18) v1(8.68,18.58) v1(8.68,17.98) v1(8.68,17.38) v1(8.68,16.78) v1(8.68,16.18) v1(8.68,15.3) v1(8.68,11.38) v1(8.68,10.78) v1(8.68,10.18) v1(8.68,9.58) v1(8.68,8.98) v1(8.68,8.38) v1(8.68,7.78) v1(8.68,7.18) v1(8.68,6.58) v1(8.68,5.98) v1(8.68,5.38) v1(8.68,4.78) v1(8.68,4.18) v1(8.68,3.58) v1(8.68,2.98) v1(8.68,2.38) v1(8.68,1.78) v1(8.68,1.18) v1(9.28,62.38) v1(9.28,61.78) v1(9.28,59.38) v1(9.28,55.78) v1(9.28,55.18) v1(9.28,54.58) v1(9.28,53.98) v1(9.28,53.38) v1(9.28,52.78) v1(9.28,52.18) v1(9.28,51.58) v1(9.28,50.98) v1(9.28,50.38) v1(9.28,49.78) v1(9.28,49.18) v1(9.28,48.58) v1(9.28,47.98) v1(9.28,47.38) v1(9.28,46.78) v1(9.28,46.18) v1(9.28,45.58) v1(9.28,44.98) v1(9.28,44.38) v1(9.28,43.78) v1(9.28,43.18) v1(9.28,42.58) v1(9.28,40.18) v1(9.28,39.58) v1(9.28,38.98) v1(9.28,38.38) v1(9.28,37.78) v1(9.28,19.18) v1(9.28,18.58) v1(9.28,17.98) v1(9.28,17.38) v1(9.28,16.78) v1(9.28,16.18) v1(9.28,2.98) v1(9.28,2.38) v1(9.28,1.78) v1(9.28,1.18) v1(9.88,62.38) v1(9.88,61.78) v1(9.88,61.18) v1(9.88,60.58) v1(9.88,59.98) v1(9.88,59.38) v1(9.88,58.78) v1(9.88,56.38) v1(9.88,55.78) v1(9.88,55.18) v1(9.88,54.58) v1(9.88,53.98) v1(9.88,53.38) v1(9.88,52.78) v1(9.88,52.18) v1(9.88,51.58) v1(9.88,50.98) v1(9.88,50.38) v1(9.88,49.78) v1(9.88,49.18) v1(9.88,48.58) v1(9.88,47.98) v1(9.88,47.38) v1(9.88,46.78) v1(9.88,46.18) v1(9.88,45.58) v1(9.88,44.98) v1(9.88,44.38) v1(9.88,43.78) v1(9.88,43.18) v1(9.88,42.58) v1(9.88,40.18) v1(9.88,39.58) v1(9.88,38.98) v1(9.88,38.38) v1(9.88,37.78) v1(9.88,17.98) v1(9.88,17.38) v1(9.88,16.78) v1(9.88,16.18) v1(9.88,15.58) v1(9.88,14.98) v1(9.88,1.18) v1(10.48,62.38) v1(10.48,61.78) v1(10.48,61.18) v1(10.48,60.58) v1(10.48,59.98) v1(10.48,59.38) v1(10.48,58.78) v1(10.48,56.38) v1(10.48,55.78) v1(10.48,55.18) v1(10.48,54.58) v1(10.48,53.98) v1(10.48,53.38) v1(10.48,52.78) v1(10.48,52.18) v1(10.48,51.58) v1(10.48,50.98) v1(10.48,50.38) v1(10.48,49.78) v1(10.48,49.18) v1(10.48,48.58) v1(10.48,47.98) v1(10.48,42.58) v1(10.48,39.58) v1(10.48,38.98) v1(10.48,38.38) v1(10.48,37.78) v1(10.48,37.18) v1(10.48,36.58) v1(10.48,35.98) v1(10.48,35.38) v1(10.48,1.18) v1(11.08,62.98) v1(11.08,62.38) v1(11.08,61.78) v1(11.08,59.38) v1(11.08,55.78) v1(11.08,55.18) v1(11.08,54.58) v1(11.08,53.98) v1(11.08,53.38) v1(11.08,52.78) v1(11.08,52.18) v1(11.08,51.58) v1(11.08,50.98) v1(11.08,50.38) v1(11.08,49.78) v1(11.08,49.18) v1(11.08,48.58) v1(11.08,38.98) v1(11.08,38.38) v1(11.08,37.78) v1(11.08,37.18) v1(11.08,36.58) v1(11.08,35.98) v1(11.08,35.38) v1(11.08,11.38) v1(11.08,10.78) v1(11.08,10.18) v1(11.08,9.58) v1(11.08,8.98) v1(11.08,8.38) v1(11.08,7.78) v1(11.08,1.18) v1(11.68,66.58) v1(11.68,62.98) v1(11.68,62.38) v1(11.68,61.78) v1(11.68,59.38) v1(11.68,51.58) v1(11.68,50.98) v1(11.68,50.38) v1(11.68,49.78) v1(11.68,49.18) v1(11.68,29.98) v1(11.68,29.38) v1(11.68,28.78) v1(11.68,28.18) v1(11.68,27.58) v1(11.68,26.98) v1(11.68,26.38) v1(11.68,23.98) v1(11.68,22.18) v1(11.68,21.58) v1(11.68,20.98) v1(11.68,17.38) v1(11.68,16.78) v1(11.68,16.18) v1(11.68,11.98) v1(11.68,11.38) v1(11.68,10.78) v1(11.68,10.18) v1(11.68,9.58) v1(11.68,8.98) v1(11.68,6.58) v1(11.68,5.38) v1(12.28,66.58) v1(12.28,65.98) v1(12.28,65.38) v1(12.28,64.78) v1(12.28,64.18) v1(12.28,63.58) v1(12.28,62.98) v1(12.28,62.38) v1(12.28,61.78) v1(12.28,59.38) v1(12.28,51.58) v1(12.28,50.98) v1(12.28,50.38) v1(12.28,49.78) v1(12.28,40.18) v1(12.28,30.58) v1(12.28,29.98) v1(12.28,29.38) v1(12.28,28.78) v1(12.28,28.18) v1(12.28,27.58) v1(12.28,26.98) v1(12.28,26.38) v1(12.28,22.18) v1(12.28,21.58) v1(12.28,20.98) v1(12.28,17.38) v1(12.28,16.78) v1(12.28,16.18) v1(12.28,15.58) v1(12.28,11.98) v1(12.28,11.38) v1(12.28,10.78) v1(12.28,10.18) v1(12.28,9.58) v1(12.28,8.98) v1(12.88,66.58) v1(12.88,65.98) v1(12.88,65.38) v1(12.88,64.78) v1(12.88,64.18) v1(12.88,63.58) v1(12.88,62.98) v1(12.88,62.38) v1(12.88,61.78) v1(12.88,61.18) v1(12.88,60.58) v1(12.88,59.98) v1(12.88,59.38) v1(12.88,58.78) v1(12.88,51.58) v1(12.88,50.98) v1(12.88,50.38) v1(12.88,46.18) v1(12.88,44.38) v1(12.88,43.78) v1(12.88,22.18) v1(12.88,21.58) v1(12.88,20.98) v1(12.88,17.38) v1(12.88,16.78) v1(12.88,16.18) v1(12.88,15.58) v1(12.88,14.98) v1(12.88,11.98) v1(12.88,11.38) v1(12.88,10.78) v1(12.88,10.18) v1(12.88,9.58) v1(12.88,8.98) v1(13.48,66.58) v1(13.48,65.98) v1(13.48,65.38) v1(13.48,64.78) v1(13.48,64.18) v1(13.48,63.58) v1(13.48,62.98) v1(13.48,62.38) v1(13.48,61.78) v1(13.48,61.18) v1(13.48,60.58) v1(13.48,59.98) v1(13.48,59.38) v1(13.48,58.78) v1(13.48,58.18) v1(13.48,57.58) v1(13.48,53.38) v1(13.48,52.78) v1(13.48,52.18) v1(13.48,51.58) v1(13.48,50.98) v1(13.48,46.78) v1(13.48,44.38) v1(13.48,43.78) v1(13.48,43.18) v1(13.48,32.98) v1(13.48,32.38) v1(13.48,25.18) v1(13.48,22.18) v1(13.48,21.58) v1(13.48,20.98) v1(13.48,17.38) v1(13.48,16.78) v1(13.48,16.18) v1(13.48,15.58) v1(13.48,14.98) v1(13.48,11.98) v1(13.48,11.38) v1(13.48,10.78) v1(13.48,10.18) v1(13.48,9.58) v1(13.48,8.98) v1(13.48,6.58) v1(13.48,5.98) v1(13.48,5.38) v1(13.48,1.18) v1(14.08,66.58) v1(14.08,65.98) v1(14.08,65.38) v1(14.08,64.78) v1(14.08,64.18) v1(14.08,63.58) v1(14.08,62.98) v1(14.08,62.38) v1(14.08,61.78) v1(14.08,61.18) v1(14.08,60.58) v1(14.08,59.98) v1(14.08,59.38) v1(14.08,58.78) v1(14.08,58.18) v1(14.08,57.58) v1(14.08,56.98) v1(14.08,51.58) v1(14.08,47.38) v1(14.08,46.78) v1(14.08,44.38) v1(14.08,43.78) v1(14.08,43.18) v1(14.08,42.58) v1(14.08,33.58) v1(14.08,32.98) v1(14.08,32.38) v1(14.08,31.78) v1(14.08,31.18) v1(14.08,30.58) v1(14.08,29.98) v1(14.08,29.38) v1(14.08,28.78) v1(14.08,28.18) v1(14.08,27.58) v1(14.08,26.98) v1(14.08,26.38) v1(14.08,24.58) v1(14.08,21.58) v1(14.08,20.98) v1(14.08,17.38) v1(14.08,16.78) v1(14.08,11.98) v1(14.08,11.38) v1(14.08,10.78) v1(14.08,10.18) v1(14.08,9.58) v1(14.08,8.98) v1(14.08,8.38) v1(14.08,7.78) v1(14.08,7.18) v1(14.08,6.58) v1(14.08,5.98) v1(14.08,5.38) v1(14.08,2.98) v1(14.08,2.38) v1(14.08,1.78) v1(14.08,1.18) v1(14.68,66.58) v1(14.68,65.98) v1(14.68,65.38) v1(14.68,64.78) v1(14.68,64.18) v1(14.68,63.58) v1(14.68,62.98) v1(14.68,62.38) v1(14.68,61.78) v1(14.68,61.18) v1(14.68,60.58) v1(14.68,59.98) v1(14.68,59.38) v1(14.68,58.78) v1(14.68,58.18) v1(14.68,57.58) v1(14.68,56.98) v1(14.68,56.38) v1(14.68,51.58) v1(14.68,47.98) v1(14.68,47.38) v1(14.68,46.78) v1(14.68,46.18) v1(14.68,45.58) v1(14.68,44.98) v1(14.68,44.38) v1(14.68,43.78) v1(14.68,43.18) v1(14.68,42.58) v1(14.68,34.18) v1(14.68,33.58) v1(14.68,32.98) v1(14.68,32.38) v1(14.68,31.78) v1(14.68,29.98) v1(14.68,26.98) v1(14.68,26.38) v1(14.68,25.78) v1(14.68,23.98) v1(14.68,20.98) v1(14.68,17.38) v1(14.68,16.78) v1(14.68,11.98) v1(14.68,11.38) v1(14.68,10.78) v1(14.68,10.18) v1(14.68,9.58) v1(14.68,8.98) v1(14.68,8.38) v1(14.68,7.78) v1(14.68,7.18) v1(14.68,6.58) v1(14.68,5.98) v1(14.68,5.38) v1(14.68,4.78) v1(14.68,2.98) v1(14.68,2.38) v1(14.68,1.78) v1(14.68,1.18) v1(15.28,66.58) v1(15.28,65.98) v1(15.28,65.38) v1(15.28,64.78) v1(15.28,64.18) v1(15.28,63.58) v1(15.28,62.98) v1(15.28,62.38) v1(15.28,61.78) v1(15.28,61.18) v1(15.28,60.58) v1(15.28,59.98) v1(15.28,59.38) v1(15.28,58.78) v1(15.28,58.18) v1(15.28,57.58) v1(15.28,56.98) v1(15.28,56.38) v1(15.28,51.58) v1(15.28,48.58) v1(15.28,47.98) v1(15.28,47.38) v1(15.28,46.78) v1(15.28,43.78) v1(15.28,43.18) v1(15.28,42.58) v1(15.28,40.18) v1(15.28,39.58) v1(15.28,38.98) v1(15.28,38.38) v1(15.28,37.78) v1(15.28,37.18) v1(15.28,36.58) v1(15.28,35.98) v1(15.28,35.38) v1(15.28,34.78) v1(15.28,34.18) v1(15.28,33.58) v1(15.28,32.98) v1(15.28,32.38) v1(15.28,31.78) v1(15.28,29.98) v1(15.28,26.98) v1(15.28,26.38) v1(15.28,25.78) v1(15.28,25.18) v1(15.28,17.38) v1(15.28,16.78) v1(15.28,11.98) v1(15.28,10.18) v1(15.28,7.78) v1(15.28,7.18) v1(15.28,6.58) v1(15.28,5.98) v1(15.28,5.38) v1(15.28,4.78) v1(15.28,3.58) v1(15.28,2.98) v1(15.28,2.38) v1(15.28,1.78) v1(15.28,1.18) v1(15.88,66.58) v1(15.88,65.98) v1(15.88,65.38) v1(15.88,64.78) v1(15.88,64.18) v1(15.88,63.58) v1(15.88,62.98) v1(15.88,62.38) v1(15.88,61.78) v1(15.88,61.18) v1(15.88,60.58) v1(15.88,51.58) v1(15.88,48.58) v1(15.88,47.98) v1(15.88,47.38) v1(15.88,46.78) v1(15.88,35.38) v1(15.88,34.78) v1(15.88,34.18) v1(15.88,33.58) v1(15.88,32.98) v1(15.88,32.38) v1(15.88,31.78) v1(15.88,29.98) v1(15.88,26.98) v1(15.88,26.38) v1(15.88,25.78) v1(15.88,25.18) v1(15.88,24.58) v1(15.88,16.78) v1(15.88,12.58) v1(15.88,7.78) v1(15.88,7.18) v1(15.88,6.58) v1(15.88,5.98) v1(15.88,5.38) v1(15.88,4.78) v1(15.88,3.58) v1(15.88,2.98) v1(15.88,2.38) v1(15.88,1.78) v1(15.88,1.18) v1(16.48,66.58) v1(16.48,65.98) v1(16.48,65.38) v1(16.48,64.78) v1(16.48,64.18) v1(16.48,63.58) v1(16.48,62.98) v1(16.48,62.38) v1(16.48,61.78) v1(16.48,61.18) v1(16.48,51.58) v1(16.48,48.58) v1(16.48,47.98) v1(16.48,47.38) v1(16.48,46.78) v1(16.48,34.78) v1(16.48,34.18) v1(16.48,33.58) v1(16.48,32.98) v1(16.48,32.38) v1(16.48,31.78) v1(16.48,29.98) v1(16.48,26.98) v1(16.48,26.38) v1(16.48,25.78) v1(16.48,25.18) v1(16.48,24.58) v1(16.48,23.98) v1(16.48,22.18) v1(16.48,12.58) v1(16.48,7.78) v1(16.48,7.18) v1(16.48,6.58) v1(16.48,5.98) v1(16.48,5.38) v1(16.48,3.58) v1(16.48,2.98) v1(16.48,2.38) v1(16.48,1.78) v1(16.48,1.18) v1(17.08,66.58) v1(17.08,65.98) v1(17.08,65.38) v1(17.08,64.78) v1(17.08,64.18) v1(17.08,63.58) v1(17.08,62.98) v1(17.08,62.38) v1(17.08,61.78) v1(17.08,51.58) v1(17.08,48.58) v1(17.08,47.98) v1(17.08,47.38) v1(17.08,46.78) v1(17.08,44.38) v1(17.08,43.78) v1(17.08,43.18) v1(17.08,42.58) v1(17.08,40.18) v1(17.08,39.58) v1(17.08,38.98) v1(17.08,38.38) v1(17.08,37.78) v1(17.08,37.18) v1(17.08,36.58) v1(17.08,34.18) v1(17.08,33.58) v1(17.08,32.98) v1(17.08,32.38) v1(17.08,31.78) v1(17.08,29.98) v1(17.08,26.98) v1(17.08,26.38) v1(17.08,25.78) v1(17.08,25.18) v1(17.08,24.58) v1(17.08,23.98) v1(17.08,21.58) v1(17.08,7.78) v1(17.08,7.18) v1(17.08,6.58) v1(17.08,5.98) v1(17.08,4.18) v1(17.08,3.58) v1(17.08,2.98) v1(17.08,2.38) v1(17.08,1.78) v1(17.08,1.18) v1(17.68,66.58) v1(17.68,65.98) v1(17.68,65.38) v1(17.68,64.78) v1(17.68,64.18) v1(17.68,63.58) v1(17.68,62.98) v1(17.68,62.38) v1(17.68,61.78) v1(17.68,58.78) v1(17.68,56.38) v1(17.68,51.58) v1(17.68,48.58) v1(17.68,47.98) v1(17.68,47.38) v1(17.68,46.78) v1(17.68,44.38) v1(17.68,43.78) v1(17.68,43.18) v1(17.68,42.58) v1(17.68,40.18) v1(17.68,39.58) v1(17.68,38.98) v1(17.68,38.38) v1(17.68,37.78) v1(17.68,37.18) v1(17.68,36.58) v1(17.68,35.98) v1(17.68,33.58) v1(17.68,32.98) v1(17.68,32.38) v1(17.68,31.78) v1(17.68,29.98) v1(17.68,26.98) v1(17.68,26.38) v1(17.68,25.78) v1(17.68,25.18) v1(17.68,24.58) v1(17.68,20.98) v1(17.68,7.78) v1(17.68,7.18) v1(17.68,6.58) v1(17.68,4.78) v1(17.68,4.18) v1(17.68,3.58) v1(17.68,2.98) v1(17.68,2.38) v1(17.68,1.78) v1(17.68,1.18) v1(18.28,66.58) v1(18.28,65.98) v1(18.28,65.38) v1(18.28,64.78) v1(18.28,64.18) v1(18.28,63.58) v1(18.28,62.98) v1(18.28,62.38) v1(18.28,48.58) v1(18.28,47.98) v1(18.28,47.38) v1(18.28,46.78) v1(18.28,36.58) v1(18.28,35.98) v1(18.28,35.38) v1(18.28,32.98) v1(18.28,32.38) v1(18.28,31.78) v1(18.28,29.98) v1(18.28,26.98) v1(18.28,26.38) v1(18.28,25.78) v1(18.28,25.18) v1(18.28,22.78) v1(18.28,22.18) v1(18.28,7.78) v1(18.28,7.18) v1(18.28,5.38) v1(18.28,4.78) v1(18.28,4.18) v1(18.28,3.58) v1(18.28,2.98) v1(18.28,2.38) v1(18.28,1.78) v1(18.28,1.18) v1(18.88,66.58) v1(18.88,65.98) v1(18.88,64.18) v1(18.88,63.58) v1(18.88,62.98) v1(18.88,62.38) v1(18.88,48.58) v1(18.88,47.98) v1(18.88,47.38) v1(18.88,46.78) v1(18.88,35.98) v1(18.88,35.38) v1(18.88,34.78) v1(18.88,32.38) v1(18.88,31.78) v1(18.88,31.18) v1(18.88,30.58) v1(18.88,29.98) v1(18.88,29.38) v1(18.88,28.78) v1(18.88,28.18) v1(18.88,27.58) v1(18.88,26.98) v1(18.88,26.38) v1(18.88,25.78) v1(18.88,23.38) v1(18.88,22.78) v1(18.88,22.18) v1(18.88,21.58) v1(18.88,7.78) v1(18.88,5.98) v1(18.88,5.38) v1(18.88,4.78) v1(18.88,4.18) v1(18.88,3.58) v1(18.88,2.98) v1(18.88,2.38) v1(18.88,1.78) v1(18.88,1.18) v1(19.48,66.58) v1(19.48,62.98) v1(19.48,62.38) v1(19.48,47.98) v1(19.48,47.38) v1(19.48,46.78) v1(19.48,43.78) v1(19.48,43.18) v1(19.48,40.18) v1(19.48,39.58) v1(19.48,38.98) v1(19.48,38.38) v1(19.48,37.78) v1(19.48,35.38) v1(19.48,34.78) v1(19.48,34.18) v1(19.48,31.78) v1(19.48,31.18) v1(19.48,30.58) v1(19.48,29.98) v1(19.48,29.38) v1(19.48,28.78) v1(19.48,28.18) v1(19.48,27.58) v1(19.48,26.98) v1(19.48,26.38) v1(19.48,23.98) v1(19.48,23.38) v1(19.48,22.78) v1(19.48,22.18) v1(19.48,21.58) v1(19.48,20.98) v1(19.48,6.58) v1(19.48,5.98) v1(19.48,5.38) v1(19.48,4.78) v1(19.48,4.18) v1(19.48,3.58) v1(19.48,2.98) v1(19.48,2.38) v1(19.48,1.78) v1(19.48,1.18) v1(20.08,62.98) v1(20.08,62.38) v1(20.08,61.78) v1(20.08,59.38) v1(20.08,58.78) v1(20.08,56.38) v1(20.08,55.78) v1(20.08,55.18) v1(20.08,52.18) v1(20.08,51.58) v1(20.08,47.38) v1(20.08,46.78) v1(20.08,43.78) v1(20.08,40.78) v1(20.08,40.18) v1(20.08,39.58) v1(20.08,38.98) v1(20.08,38.38) v1(20.08,37.78) v1(20.08,37.18) v1(20.08,34.78) v1(20.08,34.18) v1(20.08,33.58) v1(20.08,31.18) v1(20.08,30.58) v1(20.08,29.98) v1(20.08,29.38) v1(20.08,28.78) v1(20.08,28.18) v1(20.08,27.58) v1(20.08,26.98) v1(20.08,24.58) v1(20.08,23.98) v1(20.08,23.38) v1(20.08,22.78) v1(20.08,22.18) v1(20.08,21.58) v1(20.08,20.98) v1(20.08,10.78) v1(20.08,10.18) v1(20.08,7.78) v1(20.08,7.18) v1(20.08,6.58) v1(20.08,5.98) v1(20.08,5.38) v1(20.08,4.78) v1(20.08,4.18) v1(20.08,3.58) v1(20.08,2.98) v1(20.08,2.38) v1(20.08,1.78) v1(20.08,1.18) v1(20.68,62.38) v1(20.68,61.78) v1(20.68,59.38) v1(20.68,58.78) v1(20.68,56.38) v1(20.68,51.58) v1(20.68,41.38) v1(20.68,40.78) v1(20.68,40.18) v1(20.68,39.58) v1(20.68,38.98) v1(20.68,38.38) v1(20.68,37.78) v1(20.68,37.18) v1(20.68,36.58) v1(20.68,34.18) v1(20.68,33.58) v1(20.68,32.98) v1(20.68,31.18) v1(20.68,30.58) v1(20.68,29.98) v1(20.68,29.38) v1(20.68,28.78) v1(20.68,28.18) v1(20.68,27.58) v1(20.68,25.18) v1(20.68,24.58) v1(20.68,23.98) v1(20.68,23.38) v1(20.68,22.78) v1(20.68,22.18) v1(20.68,21.58) v1(20.68,20.98) v1(20.68,10.78) v1(20.68,10.18) v1(20.68,7.78) v1(20.68,7.18) v1(20.68,6.58) v1(20.68,5.98) v1(20.68,5.38) v1(20.68,4.78) v1(20.68,4.18) v1(20.68,3.58) v1(20.68,2.98) v1(20.68,2.38) v1(20.68,1.78) v1(20.68,1.18) v1(20.8,13.27) v1(21.28,62.38) v1(21.28,41.98) v1(21.28,41.38) v1(21.28,40.78) v1(21.28,40.18) v1(21.28,39.58) v1(21.28,38.98) v1(21.28,38.38) v1(21.28,37.78) v1(21.28,37.18) v1(21.28,36.58) v1(21.28,35.98) v1(21.28,33.58) v1(21.28,32.98) v1(21.28,31.18) v1(21.28,30.58) v1(21.28,29.98) v1(21.28,29.38) v1(21.28,28.78) v1(21.28,28.18) v1(21.28,25.78) v1(21.28,25.18) v1(21.28,24.58) v1(21.28,23.98) v1(21.28,23.38) v1(21.28,22.78) v1(21.28,22.18) v1(21.28,21.58) v1(21.28,20.98) v1(21.28,10.78) v1(21.28,10.18) v1(21.28,7.78) v1(21.28,7.18) v1(21.28,6.58) v1(21.28,5.98) v1(21.28,5.38) v1(21.28,2.98) v1(21.28,2.38) v1(21.28,1.78) v1(21.28,1.18) v1(21.88,62.98) v1(21.88,62.38) v1(21.88,50.38) v1(21.88,48.58) v1(21.88,47.98) v1(21.88,42.58) v1(21.88,41.98) v1(21.88,41.38) v1(21.88,40.78) v1(21.88,40.18) v1(21.88,39.58) v1(21.88,38.98) v1(21.88,38.38) v1(21.88,37.78) v1(21.88,37.18) v1(21.88,36.58) v1(21.88,35.98) v1(21.88,35.38) v1(21.88,32.98) v1(21.88,31.18) v1(21.88,30.58) v1(21.88,29.98) v1(21.88,29.38) v1(21.88,28.78) v1(21.88,26.38) v1(21.88,25.78) v1(21.88,25.18) v1(21.88,24.58) v1(21.88,23.98) v1(21.88,23.38) v1(21.88,22.78) v1(21.88,22.18) v1(21.88,21.58) v1(21.88,20.98) v1(21.88,13.78) v1(21.88,13.18) v1(21.88,10.78) v1(21.88,10.18) v1(21.88,6.58) v1(21.88,5.38) v1(21.88,1.18) v1(22.48,66.58) v1(22.48,62.98) v1(22.48,62.38) v1(22.48,51.58) v1(22.48,50.98) v1(22.48,50.38) v1(22.48,48.58) v1(22.48,47.98) v1(22.48,47.38) v1(22.48,46.78) v1(22.48,44.38) v1(22.48,43.78) v1(22.48,43.18) v1(22.48,42.58) v1(22.48,41.98) v1(22.48,41.38) v1(22.48,40.78) v1(22.48,40.18) v1(22.48,39.58) v1(22.48,38.98) v1(22.48,38.38) v1(22.48,37.78) v1(22.48,37.18) v1(22.48,36.58) v1(22.48,35.98) v1(22.48,35.38) v1(22.48,34.78) v1(22.48,31.18) v1(22.48,30.58) v1(22.48,29.98) v1(22.48,29.38) v1(22.48,26.98) v1(22.48,26.38) v1(22.48,25.78) v1(22.48,25.18) v1(22.48,24.58) v1(22.48,23.98) v1(22.48,23.38) v1(22.48,22.78) v1(22.48,22.18) v1(22.48,21.58) v1(22.48,20.98) v1(22.48,13.78) v1(22.48,13.18) v1(22.48,10.78) v1(22.48,10.18) v1(22.48,1.18) v1(23.08,66.58) v1(23.08,65.98) v1(23.08,65.38) v1(23.08,64.18) v1(23.08,63.58) v1(23.08,62.98) v1(23.08,62.38) v1(23.08,61.78) v1(23.08,59.38) v1(23.08,58.78) v1(23.08,56.38) v1(23.08,55.78) v1(23.08,51.58) v1(23.08,50.98) v1(23.08,48.58) v1(23.08,47.98) v1(23.08,47.38) v1(23.08,46.78) v1(23.08,46.18) v1(23.08,44.38) v1(23.08,43.78) v1(23.08,43.18) v1(23.08,42.58) v1(23.08,41.98) v1(23.08,41.38) v1(23.08,40.78) v1(23.08,40.18) v1(23.08,39.58) v1(23.08,38.98) v1(23.08,38.38) v1(23.08,37.78) v1(23.08,37.18) v1(23.08,36.58) v1(23.08,35.98) v1(23.08,35.38) v1(23.08,34.78) v1(23.08,34.18) v1(23.08,31.18) v1(23.08,30.58) v1(23.08,29.98) v1(23.08,29.38) v1(23.08,27.58) v1(23.08,26.98) v1(23.08,26.38) v1(23.08,25.78) v1(23.08,25.18) v1(23.08,24.58) v1(23.08,23.98) v1(23.08,23.38) v1(23.08,22.78) v1(23.08,22.18) v1(23.08,21.58) v1(23.08,20.98) v1(23.08,16.18) v1(23.08,13.18) v1(23.08,10.78) v1(23.08,10.18) v1(23.08,1.18) v1(23.68,66.58) v1(23.68,65.98) v1(23.68,65.38) v1(23.68,64.78) v1(23.68,64.18) v1(23.68,63.58) v1(23.68,62.98) v1(23.68,62.38) v1(23.68,61.78) v1(23.68,59.38) v1(23.68,58.78) v1(23.68,56.38) v1(23.68,51.58) v1(23.68,48.58) v1(23.68,47.98) v1(23.68,47.38) v1(23.68,46.78) v1(23.68,46.18) v1(23.68,43.78) v1(23.68,43.18) v1(23.68,42.58) v1(23.68,41.98) v1(23.68,41.38) v1(23.68,40.78) v1(23.68,40.18) v1(23.68,39.58) v1(23.68,38.98) v1(23.68,38.38) v1(23.68,37.78) v1(23.68,37.18) v1(23.68,36.58) v1(23.68,35.98) v1(23.68,35.38) v1(23.68,34.78) v1(23.68,34.18) v1(23.68,31.18) v1(23.68,30.58) v1(23.68,29.98) v1(23.68,28.18) v1(23.68,27.58) v1(23.68,26.98) v1(23.68,26.38) v1(23.68,25.78) v1(23.68,25.18) v1(23.68,24.58) v1(23.68,23.98) v1(23.68,23.38) v1(23.68,22.78) v1(23.68,22.18) v1(23.68,21.58) v1(23.68,20.98) v1(23.68,16.18) v1(23.68,15.58) v1(23.68,10.78) v1(23.68,10.18) v1(23.68,6.58) v1(23.68,5.98) v1(23.68,5.38) v1(23.68,1.18) v1(24.28,66.58) v1(24.28,65.98) v1(24.28,65.38) v1(24.28,64.78) v1(24.28,64.18) v1(24.28,63.58) v1(24.28,62.98) v1(24.28,62.38) v1(24.28,51.58) v1(24.28,49.18) v1(24.28,48.58) v1(24.28,47.98) v1(24.28,47.38) v1(24.28,46.78) v1(24.28,46.18) v1(24.28,43.18) v1(24.28,42.58) v1(24.28,41.98) v1(24.28,41.38) v1(24.28,40.78) v1(24.28,40.18) v1(24.28,39.58) v1(24.28,38.98) v1(24.28,38.38) v1(24.28,37.78) v1(24.28,37.18) v1(24.28,36.58) v1(24.28,35.98) v1(24.28,35.38) v1(24.28,34.78) v1(24.28,34.18) v1(24.28,31.18) v1(24.28,30.58) v1(24.28,29.98) v1(24.28,28.18) v1(24.28,27.58) v1(24.28,26.98) v1(24.28,26.38) v1(24.28,25.78) v1(24.28,25.18) v1(24.28,24.58) v1(24.28,23.98) v1(24.28,23.38) v1(24.28,22.78) v1(24.28,22.18) v1(24.28,21.58) v1(24.28,20.98) v1(24.28,16.18) v1(24.28,15.58) v1(24.28,14.98) v1(24.28,1.18) v1(24.88,66.58) v1(24.88,65.98) v1(24.88,65.38) v1(24.88,64.78) v1(24.88,64.18) v1(24.88,63.58) v1(24.88,62.98) v1(24.88,62.38) v1(24.88,50.38) v1(24.88,49.78) v1(24.88,49.18) v1(24.88,48.58) v1(24.88,47.98) v1(24.88,47.38) v1(24.88,46.78) v1(24.88,46.18) v1(24.88,45.58) v1(24.88,42.58) v1(24.88,41.98) v1(24.88,41.38) v1(24.88,40.78) v1(24.88,40.18) v1(24.88,39.58) v1(24.88,38.98) v1(24.88,38.38) v1(24.88,37.78) v1(24.88,37.18) v1(24.88,36.58) v1(24.88,35.98) v1(24.88,35.38) v1(24.88,34.78) v1(24.88,34.18) v1(24.88,31.18) v1(24.88,30.58) v1(24.88,29.98) v1(24.88,28.18) v1(24.88,27.58) v1(24.88,26.98) v1(24.88,26.38) v1(24.88,25.78) v1(24.88,25.18) v1(24.88,24.58) v1(24.88,23.98) v1(24.88,23.38) v1(24.88,22.78) v1(24.88,22.18) v1(24.88,21.58) v1(24.88,20.98) v1(24.88,16.18) v1(24.88,1.18) v1(25.48,66.58) v1(25.48,65.98) v1(25.48,65.38) v1(25.48,64.78) v1(25.48,64.18) v1(25.48,63.58) v1(25.48,62.98) v1(25.48,62.38) v1(25.48,51.58) v1(25.48,50.98) v1(25.48,50.38) v1(25.48,47.38) v1(25.48,46.78) v1(25.48,46.18) v1(25.48,45.58) v1(25.48,44.98) v1(25.48,41.98) v1(25.48,41.38) v1(25.48,40.78) v1(25.48,40.18) v1(25.48,39.58) v1(25.48,38.98) v1(25.48,38.38) v1(25.48,37.78) v1(25.48,37.18) v1(25.48,16.18) v1(25.48,1.18) v1(26.08,66.58) v1(26.08,65.98) v1(26.08,65.38) v1(26.08,64.78) v1(26.08,64.18) v1(26.08,63.58) v1(26.08,62.98) v1(26.08,62.38) v1(26.08,61.78) v1(26.08,59.38) v1(26.08,58.78) v1(26.08,56.38) v1(26.08,55.78) v1(26.08,55.18) v1(26.08,52.78) v1(26.08,52.18) v1(26.08,51.58) v1(26.08,46.18) v1(26.08,45.58) v1(26.08,44.98) v1(26.08,44.38) v1(26.08,41.38) v1(26.08,40.78) v1(26.08,40.18) v1(26.08,39.58) v1(26.08,38.98) v1(26.08,38.38) v1(26.08,37.78) v1(26.08,19.18) v1(26.08,18.58) v1(26.08,16.18) v1(26.08,2.98) v1(26.08,2.38) v1(26.08,1.78) v1(26.08,1.18) v1(26.68,66.58) v1(26.68,65.98) v1(26.68,64.18) v1(26.68,63.58) v1(26.68,62.98) v1(26.68,62.38) v1(26.68,61.78) v1(26.68,61.18) v1(26.68,59.98) v1(26.68,59.38) v1(26.68,58.78) v1(26.68,58.18) v1(26.68,56.98) v1(26.68,56.38) v1(26.68,55.78) v1(26.68,55.18) v1(26.68,52.78) v1(26.68,52.18) v1(26.68,51.58) v1(26.68,46.18) v1(26.68,45.58) v1(26.68,44.98) v1(26.68,44.38) v1(26.68,43.78) v1(26.68,41.38) v1(26.68,40.78) v1(26.68,40.18) v1(26.68,39.58) v1(26.68,38.98) v1(26.68,38.38) v1(26.68,37.78) v1(26.68,19.18) v1(26.68,18.58) v1(26.68,16.18) v1(26.68,15.58) v1(26.68,14.98) v1(26.68,14.38) v1(26.68,11.98) v1(26.68,11.38) v1(26.68,10.78) v1(26.68,10.18) v1(26.68,9.58) v1(26.68,8.98) v1(26.68,8.38) v1(26.68,7.78) v1(26.68,3.58) v1(26.68,2.98) v1(26.68,2.38) v1(26.68,1.78) v1(26.68,1.18) v1(27.28,66.58) v1(27.28,62.98) v1(27.28,62.38) v1(27.28,61.78) v1(27.28,59.38) v1(27.28,58.78) v1(27.28,56.38) v1(27.28,55.78) v1(27.28,55.18) v1(27.28,52.78) v1(27.28,52.18) v1(27.28,45.58) v1(27.28,44.98) v1(27.28,44.38) v1(27.28,43.78) v1(27.28,41.38) v1(27.28,40.78) v1(27.28,40.18) v1(27.28,39.58) v1(27.28,38.98) v1(27.28,38.38) v1(27.28,37.78) v1(27.28,19.18) v1(27.28,18.58) v1(27.28,16.18) v1(27.28,15.58) v1(27.28,14.98) v1(27.28,14.38) v1(27.28,13.78) v1(27.28,13.18) v1(27.28,12.58) v1(27.28,11.98) v1(27.28,11.38) v1(27.28,10.78) v1(27.28,10.18) v1(27.28,9.58) v1(27.28,8.98) v1(27.28,8.38) v1(27.28,7.78) v1(27.28,3.58) v1(27.28,2.98) v1(27.28,2.38) v1(27.28,1.78) v1(27.28,1.18) v1(27.88,62.98) v1(27.88,62.38) v1(27.88,55.78) v1(27.88,55.18) v1(27.88,52.78) v1(27.88,52.18) v1(27.88,45.58) v1(27.88,44.98) v1(27.88,44.38) v1(27.88,43.78) v1(27.88,41.38) v1(27.88,38.38) v1(27.88,37.78) v1(27.88,37.18) v1(27.88,36.58) v1(27.88,35.98) v1(27.88,32.98) v1(27.88,32.38) v1(27.88,31.78) v1(27.88,23.38) v1(27.88,22.78) v1(27.88,22.18) v1(27.88,21.58) v1(27.88,19.78) v1(27.88,19.18) v1(27.88,18.58) v1(27.88,16.18) v1(27.88,15.58) v1(27.88,14.98) v1(27.88,14.38) v1(27.88,13.78) v1(27.88,13.18) v1(27.88,12.58) v1(27.88,11.98) v1(27.88,11.38) v1(27.88,10.78) v1(27.88,10.18) v1(27.88,9.58) v1(27.88,8.98) v1(27.88,8.38) v1(27.88,7.78) v1(27.88,3.58) v1(27.88,2.98) v1(27.88,2.38) v1(27.88,1.78) v1(27.88,1.18) v1(28.48,62.38) v1(28.48,61.78) v1(28.48,59.38) v1(28.48,58.78) v1(28.48,56.38) v1(28.48,55.78) v1(28.48,55.18) v1(28.48,52.78) v1(28.48,52.18) v1(28.48,45.58) v1(28.48,44.98) v1(28.48,44.38) v1(28.48,43.78) v1(28.48,41.38) v1(28.48,37.78) v1(28.48,37.18) v1(28.48,36.58) v1(28.48,32.98) v1(28.48,22.78) v1(28.48,22.18) v1(28.48,21.58) v1(28.48,19.78) v1(28.48,19.18) v1(28.48,18.58) v1(28.48,16.18) v1(28.48,15.58) v1(28.48,14.98) v1(28.48,14.38) v1(28.48,13.78) v1(28.48,13.18) v1(28.48,12.58) v1(28.48,11.98) v1(28.48,11.38) v1(28.48,10.78) v1(28.48,10.18) v1(28.48,9.58) v1(28.48,8.98) v1(28.48,8.38) v1(28.48,7.78) v1(28.48,3.58) v1(28.48,2.98) v1(28.48,2.38) v1(28.48,1.78) v1(28.48,1.18) v1(29.08,62.38) v1(29.08,61.78) v1(29.08,61.18) v1(29.08,59.98) v1(29.08,59.38) v1(29.08,58.78) v1(29.08,58.18) v1(29.08,56.98) v1(29.08,56.38) v1(29.08,55.78) v1(29.08,55.18) v1(29.08,52.78) v1(29.08,52.18) v1(29.08,45.58) v1(29.08,44.98) v1(29.08,44.38) v1(29.08,43.78) v1(29.08,41.38) v1(29.08,37.78) v1(29.08,37.18) v1(29.08,36.58) v1(29.08,32.98) v1(29.08,22.78) v1(29.08,22.18) v1(29.08,21.58) v1(29.08,19.78) v1(29.08,19.18) v1(29.08,18.58) v1(29.08,16.18) v1(29.08,15.58) v1(29.08,14.98) v1(29.08,14.38) v1(29.08,13.78) v1(29.08,13.18) v1(29.08,12.58) v1(29.08,11.98) v1(29.08,11.38) v1(29.08,10.78) v1(29.08,10.18) v1(29.08,9.58) v1(29.08,8.98) v1(29.08,8.38) v1(29.08,7.78) v1(29.08,3.58) v1(29.08,2.98) v1(29.08,2.38) v1(29.08,1.78) v1(29.08,1.18) v1(29.68,62.98) v1(29.68,62.38) v1(29.68,61.78) v1(29.68,61.18) v1(29.68,59.98) v1(29.68,59.38) v1(29.68,58.78) v1(29.68,58.18) v1(29.68,56.98) v1(29.68,56.38) v1(29.68,55.78) v1(29.68,55.18) v1(29.68,52.78) v1(29.68,52.18) v1(29.68,51.58) v1(29.68,46.18) v1(29.68,45.58) v1(29.68,44.98) v1(29.68,44.38) v1(29.68,43.78) v1(29.68,41.38) v1(29.68,37.78) v1(29.68,37.18) v1(29.68,36.58) v1(29.68,22.78) v1(29.68,22.18) v1(29.68,21.58) v1(29.68,19.78) v1(29.68,19.18) v1(29.68,18.58) v1(29.68,16.18) v1(29.68,15.58) v1(29.68,14.98) v1(29.68,14.38) v1(29.68,13.78) v1(29.68,13.18) v1(29.68,12.58) v1(29.68,11.98) v1(29.68,11.38) v1(29.68,10.78) v1(29.68,10.18) v1(29.68,9.58) v1(29.68,8.98) v1(29.68,8.38) v1(29.68,7.78) v1(29.68,3.58) v1(29.68,2.98) v1(29.68,2.38) v1(29.68,1.78) v1(29.68,1.18) v1(30.28,66.58) v1(30.28,62.98) v1(30.28,62.38) v1(30.28,61.78) v1(30.28,59.38) v1(30.28,58.78) v1(30.28,56.38) v1(30.28,55.78) v1(30.28,55.18) v1(30.28,52.78) v1(30.28,52.18) v1(30.28,51.58) v1(30.28,50.98) v1(30.28,46.78) v1(30.28,46.18) v1(30.28,45.58) v1(30.28,44.98) v1(30.28,44.38) v1(30.28,43.78) v1(30.28,41.38) v1(30.28,37.78) v1(30.28,37.18) v1(30.28,36.58) v1(30.28,21.58) v1(30.28,19.78) v1(30.28,19.18) v1(30.28,18.58) v1(30.28,16.18) v1(30.28,15.58) v1(30.28,14.98) v1(30.28,14.38) v1(30.28,13.78) v1(30.28,13.18) v1(30.28,12.58) v1(30.28,11.98) v1(30.28,11.38) v1(30.28,10.78) v1(30.28,10.18) v1(30.28,9.58) v1(30.28,8.98) v1(30.28,8.38) v1(30.28,7.78) v1(30.28,3.58) v1(30.28,2.98) v1(30.28,2.38) v1(30.28,1.78) v1(30.28,1.18) v1(30.88,66.58) v1(30.88,65.98) v1(30.88,65.38) v1(30.88,64.18) v1(30.88,63.58) v1(30.88,62.98) v1(30.88,62.38) v1(30.88,55.78) v1(30.88,55.18) v1(30.88,52.78) v1(30.88,52.18) v1(30.88,51.58) v1(30.88,50.98) v1(30.88,50.38) v1(30.88,49.78) v1(30.88,47.98) v1(30.88,47.38) v1(30.88,46.78) v1(30.88,46.18) v1(30.88,45.58) v1(30.88,44.98) v1(30.88,44.38) v1(30.88,43.78) v1(30.88,41.38) v1(30.88,38.38) v1(30.88,37.78) v1(30.88,37.18) v1(30.88,36.58) v1(30.88,35.98) v1(30.88,35.38) v1(30.88,34.78) v1(30.88,34.18) v1(30.88,33.58) v1(30.88,21.58) v1(30.88,19.78) v1(30.88,19.18) v1(30.88,18.58) v1(30.88,16.18) v1(30.88,15.58) v1(30.88,14.98) v1(30.88,14.38) v1(30.88,13.78) v1(30.88,13.18) v1(30.88,12.58) v1(30.88,11.98) v1(30.88,11.38) v1(30.88,10.78) v1(30.88,10.18) v1(30.88,9.58) v1(30.88,8.98) v1(30.88,8.38) v1(30.88,7.78) v1(30.88,3.58) v1(30.88,2.98) v1(30.88,2.38) v1(30.88,1.78) v1(30.88,1.18) v1(31.48,66.58) v1(31.48,65.98) v1(31.48,65.38) v1(31.48,64.78) v1(31.48,64.18) v1(31.48,63.58) v1(31.48,62.98) v1(31.48,62.38) v1(31.48,61.78) v1(31.48,59.38) v1(31.48,58.78) v1(31.48,56.38) v1(31.48,55.78) v1(31.48,55.18) v1(31.48,52.78) v1(31.48,52.18) v1(31.48,51.58) v1(31.48,50.98) v1(31.48,50.38) v1(31.48,49.78) v1(31.48,49.18) v1(31.48,48.58) v1(31.48,47.98) v1(31.48,47.38) v1(31.48,46.78) v1(31.48,46.18) v1(31.48,45.58) v1(31.48,44.98) v1(31.48,44.38) v1(31.48,43.78) v1(31.48,41.38) v1(31.48,37.78) v1(31.48,37.18) v1(31.48,36.58) v1(31.48,21.58) v1(31.48,19.78) v1(31.48,19.18) v1(31.48,18.58) v1(31.48,16.18) v1(31.48,15.58) v1(31.48,14.98) v1(31.48,14.38) v1(31.48,13.78) v1(31.48,13.18) v1(31.48,12.58) v1(31.48,11.98) v1(31.48,11.38) v1(31.48,10.78) v1(31.48,10.18) v1(31.48,9.58) v1(31.48,8.98) v1(31.48,8.38) v1(31.48,7.78) v1(31.48,3.58) v1(31.48,2.98) v1(31.48,2.38) v1(31.48,1.78) v1(31.48,1.18) v1(32.08,66.58) v1(32.08,65.98) v1(32.08,65.38) v1(32.08,64.78) v1(32.08,64.18) v1(32.08,63.58) v1(32.08,62.98) v1(32.08,62.38) v1(32.08,61.78) v1(32.08,61.18) v1(32.08,59.98) v1(32.08,59.38) v1(32.08,58.78) v1(32.08,58.18) v1(32.08,56.98) v1(32.08,56.38) v1(32.08,55.78) v1(32.08,55.18) v1(32.08,52.78) v1(32.08,52.18) v1(32.08,51.58) v1(32.08,50.98) v1(32.08,50.38) v1(32.08,49.78) v1(32.08,49.18) v1(32.08,48.58) v1(32.08,47.98) v1(32.08,47.38) v1(32.08,46.78) v1(32.08,46.18) v1(32.08,45.58) v1(32.08,44.98) v1(32.08,44.38) v1(32.08,43.78) v1(32.08,37.78) v1(32.08,37.18) v1(32.08,36.58) v1(32.08,19.78) v1(32.08,19.18) v1(32.08,18.58) v1(32.08,16.18) v1(32.08,15.58) v1(32.08,14.98) v1(32.08,14.38) v1(32.08,13.78) v1(32.08,13.18) v1(32.08,12.58) v1(32.08,11.98) v1(32.08,9.58) v1(32.08,8.98) v1(32.08,8.38) v1(32.08,7.78) v1(32.08,3.58) v1(32.08,2.98) v1(32.08,2.38) v1(32.08,1.78) v1(32.08,1.18) v1(32.68,66.58) v1(32.68,65.98) v1(32.68,65.38) v1(32.68,64.78) v1(32.68,64.18) v1(32.68,63.58) v1(32.68,62.98) v1(32.68,62.38) v1(32.68,61.78) v1(32.68,61.18) v1(32.68,60.58) v1(32.68,59.98) v1(32.68,59.38) v1(32.68,58.78) v1(32.68,58.18) v1(32.68,57.58) v1(32.68,56.98) v1(32.68,56.38) v1(32.68,55.78) v1(32.68,55.18) v1(32.68,52.78) v1(32.68,52.18) v1(32.68,51.58) v1(32.68,50.98) v1(32.68,50.38) v1(32.68,49.78) v1(32.68,49.18) v1(32.68,48.58) v1(32.68,47.98) v1(32.68,47.38) v1(32.68,46.78) v1(32.68,46.18) v1(32.68,45.58) v1(32.68,44.98) v1(32.68,44.38) v1(32.68,43.78) v1(32.68,37.18) v1(32.68,36.58) v1(32.68,19.78) v1(32.68,19.18) v1(32.68,18.58) v1(32.68,16.18) v1(32.68,15.58) v1(32.68,14.98) v1(32.68,14.38) v1(32.68,13.78) v1(32.68,13.18) v1(32.68,12.58) v1(32.68,11.98) v1(32.68,9.58) v1(32.68,8.98) v1(32.68,8.38) v1(32.68,7.78) v1(32.68,3.58) v1(32.68,2.98) v1(32.68,2.38) v1(32.68,1.78) v1(32.68,1.18) v1(33.28,66.58) v1(33.28,65.98) v1(33.28,65.38) v1(33.28,64.78) v1(33.28,64.18) v1(33.28,63.58) v1(33.28,62.98) v1(33.28,62.38) v1(33.28,61.78) v1(33.28,61.18) v1(33.28,60.58) v1(33.28,59.98) v1(33.28,59.38) v1(33.28,58.78) v1(33.28,58.18) v1(33.28,57.58) v1(33.28,56.98) v1(33.28,56.38) v1(33.28,55.78) v1(33.28,55.18) v1(33.28,52.78) v1(33.28,52.18) v1(33.28,51.58) v1(33.28,50.98) v1(33.28,50.38) v1(33.28,49.78) v1(33.28,49.18) v1(33.28,48.58) v1(33.28,47.98) v1(33.28,47.38) v1(33.28,46.78) v1(33.28,46.18) v1(33.28,45.58) v1(33.28,44.98) v1(33.28,44.38) v1(33.28,43.78) v1(33.28,36.58) v1(33.28,19.18) v1(33.28,18.58) v1(33.28,16.18) v1(33.28,15.58) v1(33.28,14.98) v1(33.28,14.38) v1(33.28,13.78) v1(33.28,13.18) v1(33.28,12.58) v1(33.28,11.98) v1(33.28,9.58) v1(33.28,8.98) v1(33.28,8.38) v1(33.28,7.78) v1(33.28,3.58) v1(33.28,2.98) v1(33.28,2.38) v1(33.28,1.78) v1(33.28,1.18) v1(33.88,66.58) v1(33.88,65.98) v1(33.88,65.38) v1(33.88,64.78) v1(33.88,64.18) v1(33.88,63.58) v1(33.88,62.98) v1(33.88,62.38) v1(33.88,61.78) v1(33.88,61.18) v1(33.88,60.58) v1(33.88,59.98) v1(33.88,59.38) v1(33.88,58.78) v1(33.88,58.18) v1(33.88,57.58) v1(33.88,56.98) v1(33.88,56.38) v1(33.88,55.78) v1(33.88,55.18) v1(33.88,52.78) v1(33.88,52.18) v1(33.88,51.58) v1(33.88,50.98) v1(33.88,50.38) v1(33.88,49.78) v1(33.88,47.38) v1(33.88,46.78) v1(33.88,46.18) v1(33.88,45.58) v1(33.88,44.98) v1(33.88,44.38) v1(33.88,43.78) v1(33.88,31.78) v1(33.88,31.18) v1(33.88,30.58) v1(33.88,25.78) v1(33.88,20.98) v1(33.88,18.58) v1(33.88,16.18) v1(33.88,15.58) v1(33.88,14.98) v1(33.88,14.38) v1(33.88,13.78) v1(33.88,13.18) v1(33.88,12.58) v1(33.88,11.98) v1(33.88,9.58) v1(33.88,8.98) v1(33.88,8.38) v1(33.88,7.78) v1(33.88,3.58) v1(33.88,2.98) v1(33.88,2.38) v1(33.88,1.78) v1(33.88,1.18) v1(34.48,66.58) v1(34.48,65.98) v1(34.48,65.38) v1(34.48,64.78) v1(34.48,64.18) v1(34.48,63.58) v1(34.48,62.98) v1(34.48,62.38) v1(34.48,56.38) v1(34.48,55.78) v1(34.48,55.18) v1(34.48,52.78) v1(34.48,52.18) v1(34.48,51.58) v1(34.48,50.98) v1(34.48,46.78) v1(34.48,46.18) v1(34.48,45.58) v1(34.48,44.98) v1(34.48,44.38) v1(34.48,43.78) v1(34.48,35.38) v1(34.48,34.78) v1(34.48,34.18) v1(34.48,31.18) v1(34.48,30.58) v1(34.48,25.78) v1(34.48,23.38) v1(34.48,22.78) v1(34.48,22.18) v1(34.48,21.58) v1(34.48,20.98) v1(34.48,20.38) v1(34.48,17.98) v1(34.48,15.58) v1(34.48,14.98) v1(34.48,14.38) v1(34.48,13.78) v1(34.48,13.18) v1(34.48,12.58) v1(34.48,11.98) v1(34.48,11.38) v1(34.48,10.78) v1(34.48,10.18) v1(34.48,9.58) v1(34.48,8.98) v1(34.48,8.38) v1(34.48,7.78) v1(34.48,3.58) v1(34.48,2.98) v1(34.48,2.38) v1(34.48,1.78) v1(34.48,1.18) v1(35.08,66.58) v1(35.08,65.98) v1(35.08,65.38) v1(35.08,64.78) v1(35.08,64.18) v1(35.08,63.58) v1(35.08,62.98) v1(35.08,46.18) v1(35.08,45.58) v1(35.08,40.78) v1(35.08,40.18) v1(35.08,39.58) v1(35.08,33.58) v1(35.08,30.58) v1(35.08,25.78) v1(35.08,22.78) v1(35.08,22.18) v1(35.08,21.58) v1(35.08,20.98) v1(35.08,20.38) v1(35.08,19.78) v1(35.08,17.38) v1(35.08,14.98) v1(35.08,14.38) v1(35.08,13.78) v1(35.08,13.18) v1(35.08,12.58) v1(35.08,11.98) v1(35.08,11.38) v1(35.08,10.78) v1(35.08,10.18) v1(35.08,9.58) v1(35.08,8.98) v1(35.08,8.38) v1(35.08,3.58) v1(35.08,2.98) v1(35.08,2.38) v1(35.08,1.78) v1(35.08,1.18) v1(35.68,66.58) v1(35.68,65.98) v1(35.68,65.38) v1(35.68,64.78) v1(35.68,64.18) v1(35.68,63.58) v1(35.68,46.18) v1(35.68,45.58) v1(35.68,40.78) v1(35.68,40.18) v1(35.68,32.98) v1(35.68,30.58) v1(35.68,16.78) v1(35.68,14.38) v1(35.68,11.98) v1(35.68,11.38) v1(35.68,10.78) v1(35.68,10.18) v1(35.68,9.58) v1(35.68,5.98) v1(35.68,3.58) v1(35.68,2.98) v1(35.68,2.38) v1(35.68,1.78) v1(35.68,1.18) v1(36.28,66.58) v1(36.28,65.98) v1(36.28,65.38) v1(36.28,64.78) v1(36.28,64.18) v1(36.28,63.58) v1(36.28,46.18) v1(36.28,45.58) v1(36.28,32.98) v1(36.28,16.18) v1(36.28,11.38) v1(36.28,10.78) v1(36.28,10.18) v1(36.28,5.98) v1(36.28,3.58) v1(36.28,2.98) v1(36.28,2.38) v1(36.28,1.78) v1(36.28,1.18) v1(36.88,66.58) v1(36.88,65.98) v1(36.88,65.38) v1(36.88,64.78) v1(36.88,64.18) v1(36.88,63.58) v1(36.88,46.18) v1(36.88,45.58) v1(36.88,34.78) v1(36.88,34.18) v1(36.88,33.58) v1(36.88,32.98) v1(36.88,15.58) v1(36.88,11.38) v1(36.88,10.78) v1(36.88,10.18) v1(36.88,6.58) v1(36.88,5.98) v1(36.88,3.58) v1(36.88,2.98) v1(36.88,2.38) v1(36.88,1.78) v1(36.88,1.18) v1(37.48,66.58) v1(37.48,65.98) v1(37.48,65.38) v1(37.48,64.78) v1(37.48,64.18) v1(37.48,63.58) v1(37.48,33.58) v1(37.48,32.98) v1(37.48,29.98) v1(37.48,28.18) v1(37.48,27.58) v1(37.48,26.98) v1(37.48,26.38) v1(37.48,17.38) v1(37.48,14.98) v1(37.48,11.98) v1(37.48,11.38) v1(37.48,10.78) v1(37.48,6.58) v1(37.48,4.18) v1(37.48,3.58) v1(37.48,2.98) v1(37.48,2.38) v1(37.48,1.78) v1(37.48,1.18) v1(38.08,66.58) v1(38.08,65.98) v1(38.08,65.38) v1(38.08,64.78) v1(38.08,64.18) v1(38.08,63.58) v1(38.08,55.78) v1(38.08,55.18) v1(38.08,32.98) v1(38.08,29.98) v1(38.08,28.18) v1(38.08,27.58) v1(38.08,26.98) v1(38.08,16.78) v1(38.08,14.38) v1(38.08,13.78) v1(38.08,13.18) v1(38.08,12.58) v1(38.08,11.98) v1(38.08,11.38) v1(38.08,8.38) v1(38.08,7.78) v1(38.08,7.18) v1(38.08,4.78) v1(38.08,4.18) v1(38.08,3.58) v1(38.08,2.98) v1(38.08,2.38) v1(38.08,1.78) v1(38.08,1.18) v1(38.68,66.58) v1(38.68,65.98) v1(38.68,65.38) v1(38.68,64.78) v1(38.68,64.18) v1(38.68,63.58) v1(38.68,55.78) v1(38.68,55.18) v1(38.68,32.98) v1(38.68,28.78) v1(38.68,28.18) v1(38.68,27.58) v1(38.68,24.58) v1(38.68,23.98) v1(38.68,23.38) v1(38.68,22.78) v1(38.68,22.18) v1(38.68,21.58) v1(38.68,20.98) v1(38.68,20.38) v1(38.68,19.78) v1(38.68,19.18) v1(38.68,18.58) v1(38.68,5.38) v1(38.68,4.78) v1(38.68,4.18) v1(38.68,3.58) v1(38.68,2.98) v1(38.68,2.38) v1(38.68,1.78) v1(38.68,1.18) v1(39.28,66.58) v1(39.28,65.98) v1(39.28,65.38) v1(39.28,64.78) v1(39.28,64.18) v1(39.28,63.58) v1(39.28,55.78) v1(39.28,55.18) v1(39.28,46.18) v1(39.28,32.98) v1(39.28,29.38) v1(39.28,28.78) v1(39.28,28.18) v1(39.28,25.18) v1(39.28,24.58) v1(39.28,23.98) v1(39.28,23.38) v1(39.28,22.78) v1(39.28,22.18) v1(39.28,21.58) v1(39.28,20.98) v1(39.28,20.38) v1(39.28,19.78) v1(39.28,19.18) v1(39.28,18.58) v1(39.28,17.98) v1(39.28,5.98) v1(39.28,5.38) v1(39.28,4.78) v1(39.28,4.18) v1(39.28,3.58) v1(39.28,2.98) v1(39.28,2.38) v1(39.28,1.78) v1(39.28,1.18) v1(39.88,66.58) v1(39.88,65.98) v1(39.88,65.38) v1(39.88,64.78) v1(39.88,64.18) v1(39.88,63.58) v1(39.88,55.78) v1(39.88,55.18) v1(39.88,46.18) v1(39.88,45.58) v1(39.88,32.98) v1(39.88,29.38) v1(39.88,28.78) v1(39.88,25.78) v1(39.88,21.58) v1(39.88,20.98) v1(39.88,20.38) v1(39.88,19.78) v1(39.88,19.18) v1(39.88,18.58) v1(39.88,17.98) v1(39.88,17.38) v1(39.88,16.78) v1(39.88,16.18) v1(39.88,15.58) v1(39.88,14.98) v1(39.88,14.38) v1(39.88,13.78) v1(39.88,13.18) v1(39.88,12.58) v1(39.88,11.98) v1(39.88,9.58) v1(39.88,8.98) v1(39.88,8.38) v1(39.88,7.78) v1(39.88,7.18) v1(39.88,6.58) v1(39.88,5.98) v1(39.88,5.38) v1(39.88,4.78) v1(39.88,4.18) v1(39.88,3.58) v1(39.88,2.98) v1(39.88,2.38) v1(39.88,1.78) v1(39.88,1.18) v1(40.48,66.58) v1(40.48,65.98) v1(40.48,65.38) v1(40.48,64.78) v1(40.48,64.18) v1(40.48,63.58) v1(40.48,55.78) v1(40.48,55.18) v1(40.48,42.58) v1(40.48,26.38) v1(40.48,25.78) v1(40.48,20.98) v1(40.48,20.38) v1(40.48,19.78) v1(40.48,19.18) v1(40.48,18.58) v1(40.48,17.98) v1(40.48,17.38) v1(40.48,16.78) v1(40.48,16.18) v1(40.48,15.58) v1(40.48,14.98) v1(40.48,14.38) v1(40.48,13.78) v1(40.48,13.18) v1(40.48,12.58) v1(40.48,11.98) v1(40.48,9.58) v1(40.48,8.98) v1(40.48,8.38) v1(40.48,7.78) v1(40.48,7.18) v1(40.48,6.58) v1(40.48,5.98) v1(40.48,5.38) v1(40.48,4.78) v1(40.48,4.18) v1(40.48,3.58) v1(40.48,2.98) v1(40.48,2.38) v1(40.48,1.78) v1(40.48,1.18) v1(40.94,36.86) v1(41.08,66.58) v1(41.08,65.98) v1(41.08,65.38) v1(41.08,64.78) v1(41.08,64.18) v1(41.08,63.58) v1(41.08,55.78) v1(41.08,55.18) v1(41.08,42.58) v1(41.08,41.98) v1(41.08,38.38) v1(41.08,37.78) v1(41.08,26.98) v1(41.08,26.38) v1(41.08,25.78) v1(41.08,20.98) v1(41.08,20.38) v1(41.08,19.78) v1(41.08,19.18) v1(41.08,18.58) v1(41.08,17.98) v1(41.08,17.38) v1(41.08,16.78) v1(41.08,16.18) v1(41.08,15.58) v1(41.08,14.98) v1(41.08,14.38) v1(41.08,13.78) v1(41.08,13.18) v1(41.08,12.58) v1(41.08,11.98) v1(41.08,9.58) v1(41.08,8.98) v1(41.08,8.38) v1(41.08,7.78) v1(41.08,7.18) v1(41.08,6.58) v1(41.08,5.98) v1(41.08,5.38) v1(41.08,1.78) v1(41.08,1.18) v1(41.68,66.58) v1(41.68,65.98) v1(41.68,65.38) v1(41.68,64.78) v1(41.68,64.18) v1(41.68,63.58) v1(41.68,55.78) v1(41.68,55.18) v1(41.68,42.58) v1(41.68,41.98) v1(41.68,41.38) v1(41.68,40.78) v1(41.68,38.38) v1(41.68,37.78) v1(41.68,26.98) v1(41.68,26.38) v1(41.68,25.78) v1(41.68,20.98) v1(41.68,20.38) v1(41.68,19.78) v1(41.68,19.18) v1(41.68,18.58) v1(41.68,17.98) v1(41.68,17.38) v1(41.68,16.78) v1(41.68,16.18) v1(41.68,15.58) v1(41.68,14.98) v1(41.68,14.38) v1(41.68,13.78) v1(41.68,13.18) v1(41.68,12.58) v1(41.68,11.98) v1(41.68,11.38) v1(41.68,10.78) v1(41.68,10.18) v1(41.68,9.58) v1(41.68,8.98) v1(41.68,8.38) v1(41.68,7.78) v1(41.68,7.18) v1(41.68,6.58) v1(41.68,5.98) v1(41.68,5.38) v1(41.68,1.78) v1(41.68,1.18) v1(42.28,66.58) v1(42.28,65.98) v1(42.28,65.38) v1(42.28,64.78) v1(42.28,64.18) v1(42.28,63.58) v1(42.28,55.78) v1(42.28,55.18) v1(42.28,52.78) v1(42.28,52.18) v1(42.28,42.58) v1(42.28,41.98) v1(42.28,41.38) v1(42.28,26.98) v1(42.28,26.38) v1(42.28,25.78) v1(42.28,16.18) v1(42.28,15.58) v1(42.28,14.98) v1(42.28,14.38) v1(42.28,13.78) v1(42.28,13.18) v1(42.28,12.58) v1(42.28,11.98) v1(42.28,11.38) v1(42.28,10.78) v1(42.28,10.18) v1(42.28,9.58) v1(42.28,8.98) v1(42.28,8.38) v1(42.28,7.78) v1(42.28,7.18) v1(42.28,6.58) v1(42.28,5.98) v1(42.28,5.38) v1(42.28,1.78) v1(42.28,1.18) v1(42.88,66.58) v1(42.88,65.98) v1(42.88,65.38) v1(42.88,64.78) v1(42.88,64.18) v1(42.88,63.58) v1(42.88,55.78) v1(42.88,55.18) v1(42.88,52.78) v1(42.88,52.18) v1(42.88,44.98) v1(42.88,42.58) v1(42.88,41.98) v1(42.88,41.38) v1(42.88,40.78) v1(42.88,38.98) v1(42.88,26.98) v1(42.88,26.38) v1(42.88,25.78) v1(42.88,16.18) v1(42.88,15.58) v1(42.88,14.98) v1(42.88,14.38) v1(42.88,13.78) v1(42.88,13.18) v1(42.88,12.58) v1(42.88,11.98) v1(42.88,11.38) v1(42.88,10.78) v1(42.88,10.18) v1(42.88,9.58) v1(42.88,8.98) v1(42.88,8.38) v1(42.88,7.78) v1(42.88,7.18) v1(42.88,6.58) v1(42.88,5.98) v1(42.88,5.38) v1(42.88,4.78) v1(42.88,4.18) v1(42.88,3.58) v1(42.88,2.98) v1(42.88,2.38) v1(42.88,1.78) v1(42.88,1.18) v1(43.38,37.66) v1(43.48,66.58) v1(43.48,65.98) v1(43.48,65.38) v1(43.48,64.78) v1(43.48,64.18) v1(43.48,63.58) v1(43.48,55.78) v1(43.48,55.18) v1(43.48,44.98) v1(43.48,42.58) v1(43.48,41.98) v1(43.48,41.38) v1(43.48,40.78) v1(43.48,40.18) v1(43.48,39.58) v1(43.48,38.98) v1(43.48,26.98) v1(43.48,26.38) v1(43.48,25.78) v1(43.48,16.18) v1(43.48,15.58) v1(43.48,14.98) v1(43.48,14.38) v1(43.48,13.78) v1(43.48,13.18) v1(43.48,12.58) v1(43.48,11.98) v1(43.48,11.38) v1(43.48,10.78) v1(43.48,10.18) v1(43.48,9.58) v1(43.48,8.98) v1(43.48,8.38) v1(43.48,7.78) v1(43.48,7.18) v1(43.48,6.58) v1(43.48,5.98) v1(43.48,5.38) v1(43.48,1.18) v1(44.08,66.58) v1(44.08,65.98) v1(44.08,65.38) v1(44.08,64.78) v1(44.08,64.18) v1(44.08,63.58) v1(44.08,56.38) v1(44.08,55.78) v1(44.08,55.18) v1(44.08,44.98) v1(44.08,42.58) v1(44.08,41.98) v1(44.08,41.38) v1(44.08,40.78) v1(44.08,40.18) v1(44.08,39.58) v1(44.08,38.98) v1(44.08,26.98) v1(44.08,26.38) v1(44.08,25.78) v1(44.08,20.98) v1(44.08,17.38) v1(44.08,16.78) v1(44.08,16.18) v1(44.08,15.58) v1(44.08,14.98) v1(44.08,14.38) v1(44.08,13.78) v1(44.08,13.18) v1(44.08,12.58) v1(44.08,11.98) v1(44.08,11.38) v1(44.08,10.78) v1(44.08,10.18) v1(44.08,9.58) v1(44.08,8.98) v1(44.08,8.38) v1(44.08,7.78) v1(44.08,7.18) v1(44.08,6.58) v1(44.08,5.98) v1(44.08,1.18) v1(44.68,66.58) v1(44.68,65.98) v1(44.68,65.38) v1(44.68,64.78) v1(44.68,64.18) v1(44.68,63.58) v1(44.68,62.98) v1(44.68,62.38) v1(44.68,61.78) v1(44.68,61.18) v1(44.68,60.58) v1(44.68,58.18) v1(44.68,57.58) v1(44.68,56.98) v1(44.68,56.38) v1(44.68,55.78) v1(44.68,55.18) v1(44.68,44.98) v1(44.68,41.98) v1(44.68,41.38) v1(44.68,40.78) v1(44.68,40.18) v1(44.68,39.58) v1(44.68,38.98) v1(44.68,36.58) v1(44.68,26.98) v1(44.68,26.38) v1(44.68,25.78) v1(44.68,20.98) v1(44.68,16.78) v1(44.68,16.18) v1(44.68,15.58) v1(44.68,14.98) v1(44.68,14.38) v1(44.68,13.78) v1(44.68,13.18) v1(44.68,12.58) v1(44.68,11.98) v1(44.68,11.38) v1(44.68,10.78) v1(44.68,10.18) v1(44.68,9.58) v1(44.68,8.98) v1(44.68,8.38) v1(44.68,7.78) v1(44.68,7.18) v1(44.68,6.58) v1(44.68,5.98) v1(44.68,1.18) v1(45.28,66.58) v1(45.28,65.98) v1(45.28,65.38) v1(45.28,64.78) v1(45.28,64.18) v1(45.28,63.58) v1(45.28,62.98) v1(45.28,62.38) v1(45.28,61.78) v1(45.28,61.18) v1(45.28,60.58) v1(45.28,58.18) v1(45.28,57.58) v1(45.28,56.98) v1(45.28,56.38) v1(45.28,55.78) v1(45.28,55.18) v1(45.28,52.78) v1(45.28,44.98) v1(45.28,41.38) v1(45.28,40.78) v1(45.28,40.18) v1(45.28,39.58) v1(45.28,38.98) v1(45.28,38.38) v1(45.28,37.78) v1(45.28,37.18) v1(45.28,36.58) v1(45.28,35.98) v1(45.28,26.98) v1(45.28,26.38) v1(45.28,25.78) v1(45.28,16.18) v1(45.28,15.58) v1(45.28,14.98) v1(45.28,14.38) v1(45.28,8.98) v1(45.28,8.38) v1(45.28,7.78) v1(45.28,7.18) v1(45.28,6.58) v1(45.28,5.98) v1(45.28,1.18) v1(45.88,66.58) v1(45.88,65.98) v1(45.88,65.38) v1(45.88,64.78) v1(45.88,64.18) v1(45.88,63.58) v1(45.88,62.98) v1(45.88,62.38) v1(45.88,61.78) v1(45.88,61.18) v1(45.88,60.58) v1(45.88,58.18) v1(45.88,57.58) v1(45.88,56.98) v1(45.88,56.38) v1(45.88,55.78) v1(45.88,55.18) v1(45.88,52.78) v1(45.88,48.58) v1(45.88,44.98) v1(45.88,39.58) v1(45.88,38.98) v1(45.88,38.38) v1(45.88,37.78) v1(45.88,37.18) v1(45.88,36.58) v1(45.88,35.98) v1(45.88,35.38) v1(45.88,34.78) v1(45.88,34.18) v1(45.88,26.98) v1(45.88,8.98) v1(45.88,8.38) v1(45.88,7.78) v1(45.88,7.18) v1(45.88,6.58) v1(45.88,5.98) v1(45.88,1.18) v1(46.48,66.58) v1(46.48,65.98) v1(46.48,65.38) v1(46.48,64.78) v1(46.48,64.18) v1(46.48,63.58) v1(46.48,62.98) v1(46.48,62.38) v1(46.48,61.78) v1(46.48,61.18) v1(46.48,60.58) v1(46.48,58.18) v1(46.48,57.58) v1(46.48,56.98) v1(46.48,56.38) v1(46.48,55.78) v1(46.48,55.18) v1(46.48,52.78) v1(46.48,48.58) v1(46.48,44.98) v1(46.48,1.18) v1(47.08,66.58) v1(47.08,65.98) v1(47.08,65.38) v1(47.08,64.78) v1(47.08,64.18) v1(47.08,63.58) v1(47.08,62.98) v1(47.08,62.38) v1(47.08,61.78) v1(47.08,61.18) v1(47.08,60.58) v1(47.08,58.18) v1(47.08,57.58) v1(47.08,56.98) v1(47.08,56.38) v1(47.08,55.78) v1(47.08,55.18) v1(47.08,52.78) v1(47.08,48.58) v1(47.08,47.98) v1(47.08,44.98) v1(47.08,1.18) v1(47.68,66.58) v1(47.68,65.98) v1(47.68,65.38) v1(47.68,64.78) v1(47.68,64.18) v1(47.68,63.58) v1(47.68,62.98) v1(47.68,62.38) v1(47.68,61.78) v1(47.68,61.18) v1(47.68,60.58) v1(47.68,59.98) v1(47.68,57.58) v1(47.68,56.98) v1(47.68,56.38) v1(47.68,55.78) v1(47.68,55.18) v1(47.68,52.78) v1(47.68,48.58) v1(47.68,47.98) v1(47.68,44.98) v1(47.68,32.38) v1(47.68,16.78) v1(47.68,1.18) v1(48.28,66.58) v1(48.28,65.98) v1(48.28,65.38) v1(48.28,64.78) v1(48.28,64.18) v1(48.28,63.58) v1(48.28,62.98) v1(48.28,62.38) v1(48.28,61.78) v1(48.28,61.18) v1(48.28,60.58) v1(48.28,59.98) v1(48.28,56.98) v1(48.28,56.38) v1(48.28,55.78) v1(48.28,55.18) v1(48.28,52.78) v1(48.28,48.58) v1(48.28,47.98) v1(48.28,44.98) v1(48.28,33.58) v1(48.28,32.98) v1(48.28,32.38) v1(48.28,25.18) v1(48.28,14.38) v1(48.28,8.98) v1(48.28,8.38) v1(48.28,7.78) v1(48.28,7.18) v1(48.28,6.58) v1(48.28,5.98) v1(48.28,5.38) v1(48.28,4.78) v1(48.28,4.18) v1(48.28,3.58) v1(48.28,2.98) v1(48.28,2.38) v1(48.28,1.78) v1(48.28,1.18) v1(48.88,66.58) v1(48.88,65.98) v1(48.88,65.38) v1(48.88,64.78) v1(48.88,64.18) v1(48.88,63.58) v1(48.88,62.98) v1(48.88,55.78) v1(48.88,55.18) v1(48.88,47.98) v1(48.88,44.98) v1(48.88,40.18) v1(48.88,39.58) v1(48.88,38.98) v1(48.88,38.38) v1(48.88,37.78) v1(48.88,37.18) v1(48.88,36.58) v1(48.88,35.98) v1(48.88,35.38) v1(48.88,34.78) v1(48.88,34.18) v1(48.88,33.58) v1(48.88,32.98) v1(48.88,32.38) v1(48.88,16.18) v1(48.88,14.38) v1(48.88,13.78) v1(48.88,13.18) v1(48.88,12.58) v1(48.88,11.98) v1(48.88,11.38) v1(48.88,10.78) v1(48.88,10.18) v1(48.88,9.58) v1(48.88,8.98) v1(48.88,8.38) v1(48.88,7.78) v1(48.88,7.18) v1(48.88,6.58) v1(48.88,5.98) v1(48.88,5.38) v1(48.88,4.78) v1(48.88,4.18) v1(48.88,3.58) v1(48.88,2.98) v1(48.88,2.38) v1(48.88,1.78) v1(48.88,1.18) v1(49.48,66.58) v1(49.48,65.98) v1(49.48,65.38) v1(49.48,64.78) v1(49.48,64.18) v1(49.48,63.58) v1(49.48,44.98) v1(49.48,44.38) v1(49.48,43.78) v1(49.48,43.18) v1(49.48,42.58) v1(49.48,40.18) v1(49.48,39.58) v1(49.48,38.98) v1(49.48,38.38) v1(49.48,37.78) v1(49.48,37.18) v1(49.48,36.58) v1(49.48,35.98) v1(49.48,35.38) v1(49.48,34.78) v1(49.48,34.18) v1(49.48,26.98) v1(49.48,16.18) v1(49.48,14.38) v1(49.48,13.78) v1(49.48,13.18) v1(49.48,12.58) v1(49.48,11.98) v1(49.48,11.38) v1(49.48,10.78) v1(49.48,10.18) v1(49.48,9.58) v1(49.48,8.98) v1(49.48,8.38) v1(49.48,7.78) v1(49.48,7.18) v1(49.48,6.58) v1(49.48,5.98) v1(49.48,5.38) v1(49.48,4.78) v1(49.48,4.18) v1(49.48,3.58) v1(49.48,2.98) v1(49.48,2.38) v1(49.48,1.78) v1(49.48,1.18) v1(50.08,66.58) v1(50.08,65.98) v1(50.08,65.38) v1(50.08,64.78) v1(50.08,64.18) v1(50.08,44.38) v1(50.08,43.78) v1(50.08,43.18) v1(50.08,42.58) v1(50.08,40.18) v1(50.08,36.58) v1(50.08,35.98) v1(50.08,35.38) v1(50.08,34.78) v1(50.08,34.18) v1(50.08,26.98) v1(50.08,26.38) v1(50.08,14.38) v1(50.08,13.78) v1(50.08,13.18) v1(50.08,12.58) v1(50.08,11.98) v1(50.08,11.38) v1(50.08,10.78) v1(50.08,10.18) v1(50.08,9.58) v1(50.08,8.98) v1(50.08,8.38) v1(50.08,7.78) v1(50.08,7.18) v1(50.08,6.58) v1(50.08,5.98) v1(50.08,5.38) v1(50.08,4.78) v1(50.08,4.18) v1(50.08,3.58) v1(50.08,2.98) v1(50.08,2.38) v1(50.08,1.78) v1(50.08,1.18) v1(50.44,18.06) v1(50.68,66.58) v1(50.68,65.98) v1(50.68,65.38) v1(50.68,64.78) v1(50.68,64.18) v1(50.68,44.38) v1(50.68,43.78) v1(50.68,43.18) v1(50.68,40.18) v1(50.68,34.18) v1(50.68,26.38) v1(50.68,14.38) v1(50.68,13.78) v1(50.68,13.18) v1(50.68,12.58) v1(50.68,11.98) v1(50.68,11.38) v1(50.68,10.78) v1(50.68,10.18) v1(50.68,9.58) v1(50.68,8.98) v1(50.68,8.38) v1(50.68,7.78) v1(50.68,7.18) v1(50.68,6.58) v1(50.68,5.98) v1(50.68,1.78) v1(50.68,1.18) v1(51.28,66.58) v1(51.28,65.98) v1(51.28,65.38) v1(51.28,64.78) v1(51.28,64.18) v1(51.28,40.18) v1(51.28,33.58) v1(51.28,32.98) v1(51.28,14.98) v1(51.28,14.38) v1(51.28,13.78) v1(51.28,13.18) v1(51.28,12.58) v1(51.28,11.98) v1(51.28,11.38) v1(51.28,10.78) v1(51.28,10.18) v1(51.28,9.58) v1(51.28,8.98) v1(51.28,8.38) v1(51.28,7.78) v1(51.28,7.18) v1(51.28,6.58) v1(51.28,1.18) v1(51.88,66.58) v1(51.88,65.98) v1(51.88,65.38) v1(51.88,64.78) v1(51.88,64.18) v1(51.88,40.78) v1(51.88,40.18) v1(51.88,31.78) v1(51.88,31.18) v1(51.88,30.58) v1(51.88,15.58) v1(51.88,14.98) v1(51.88,14.38) v1(51.88,13.78) v1(51.88,13.18) v1(51.88,12.58) v1(51.88,11.98) v1(51.88,11.38) v1(51.88,10.78) v1(51.88,10.18) v1(51.88,9.58) v1(51.88,8.98) v1(51.88,8.38) v1(51.88,7.78) v1(51.88,7.18) v1(51.88,6.58) v1(51.88,1.18) v1(52.48,66.58) v1(52.48,65.98) v1(52.48,65.38) v1(52.48,64.78) v1(52.48,64.18) v1(52.48,31.78) v1(52.48,31.18) v1(52.48,30.58) v1(52.48,14.38) v1(52.48,13.78) v1(52.48,13.18) v1(52.48,12.58) v1(52.48,11.98) v1(52.48,11.38) v1(52.48,10.78) v1(52.48,10.18) v1(52.48,9.58) v1(52.48,8.98) v1(52.48,8.38) v1(52.48,7.78) v1(52.48,7.18) v1(53.08,66.58) v1(53.08,65.98) v1(53.08,65.38) v1(53.08,64.78) v1(53.08,64.18) v1(53.08,14.38) v1(53.08,13.78) v1(53.08,9.58) v1(53.08,8.98) v1(53.08,8.38) v1(53.08,7.78) v1(53.08,7.18) v1(53.68,66.58) v1(53.68,65.98) v1(53.68,65.38) v1(53.68,64.78) v1(53.68,64.18) v1(53.68,14.38) v1(53.68,13.78) v1(53.68,9.58) v1(53.68,8.98) v1(53.68,8.38) v1(53.68,7.78) v1(53.68,7.18) v1(54.28,66.58) v1(54.28,65.98) v1(54.28,65.38) v1(54.28,64.78) v1(54.28,64.18) v1(54.28,50.98) v1(54.28,47.38) v1(54.28,46.78) v1(54.28,46.18) v1(54.28,45.58) v1(54.28,44.98) v1(54.28,44.38) v1(54.28,43.78) v1(54.28,43.18) v1(54.28,42.58) v1(54.28,41.98) v1(54.28,41.38) v1(54.28,40.78) v1(54.28,40.18) v1(54.28,14.38) v1(54.28,13.78) v1(54.28,9.58) v1(54.28,8.98) v1(54.28,8.38) v1(54.28,7.78) v1(54.28,7.18) v1(54.28,6.58) v1(54.28,1.18) v1(54.88,66.58) v1(54.88,65.98) v1(54.88,65.38) v1(54.88,64.78) v1(54.88,64.18) v1(54.88,63.58) v1(54.88,51.58) v1(54.88,50.98) v1(54.88,47.38) v1(54.88,46.78) v1(54.88,46.18) v1(54.88,45.58) v1(54.88,44.98) v1(54.88,44.38) v1(54.88,43.78) v1(54.88,43.18) v1(54.88,42.58) v1(54.88,41.98) v1(54.88,41.38) v1(54.88,40.78) v1(54.88,40.18) v1(54.88,31.78) v1(54.88,31.18) v1(54.88,30.58) v1(54.88,29.98) v1(54.88,29.38) v1(54.88,28.78) v1(54.88,28.18) v1(54.88,14.38) v1(54.88,13.78) v1(54.88,9.58) v1(54.88,8.98) v1(54.88,8.38) v1(54.88,7.78) v1(54.88,7.18) v1(54.88,6.58) v1(54.88,1.18) v1(55.48,65.98) v1(55.48,65.38) v1(55.48,64.78) v1(55.48,64.18) v1(55.48,63.58) v1(55.48,62.98) v1(55.48,52.18) v1(55.48,51.58) v1(55.48,50.98) v1(55.48,50.38) v1(55.48,49.78) v1(55.48,49.18) v1(55.48,48.58) v1(55.48,47.98) v1(55.48,47.38) v1(55.48,46.78) v1(55.48,46.18) v1(55.48,45.58) v1(55.48,44.98) v1(55.48,44.38) v1(55.48,43.78) v1(55.48,43.18) v1(55.48,42.58) v1(55.48,41.98) v1(55.48,41.38) v1(55.48,40.78) v1(55.48,40.18) v1(55.48,32.38) v1(55.48,31.78) v1(55.48,31.18) v1(55.48,30.58) v1(55.48,29.98) v1(55.48,29.38) v1(55.48,28.78) v1(55.48,28.18) v1(55.48,27.58) v1(55.48,17.38) v1(55.48,16.78) v1(55.48,16.18) v1(55.48,15.58) v1(55.48,14.98) v1(55.48,14.38) v1(55.48,13.78) v1(55.48,9.58) v1(55.48,8.98) v1(55.48,8.38) v1(55.48,7.78) v1(55.48,7.18) v1(55.48,6.58) v1(55.48,5.98) v1(55.48,1.78) v1(56.08,64.78) v1(56.08,64.18) v1(56.08,63.58) v1(56.08,62.98) v1(56.08,62.38) v1(56.08,61.78) v1(56.08,61.18) v1(56.08,60.58) v1(56.08,59.98) v1(56.08,59.38) v1(56.08,58.78) v1(56.08,58.18) v1(56.08,57.58) v1(56.08,56.98) v1(56.08,56.38) v1(56.08,55.78) v1(56.08,55.18) v1(56.08,54.58) v1(56.08,53.98) v1(56.08,53.38) v1(56.08,52.78) v1(56.08,52.18) v1(56.08,51.58) v1(56.08,50.98) v1(56.08,50.38) v1(56.08,49.78) v1(56.08,49.18) v1(56.08,48.58) v1(56.08,47.98) v1(56.08,47.38) v1(56.08,46.78) v1(56.08,46.18) v1(56.08,45.58) v1(56.08,44.98) v1(56.08,44.38) v1(56.08,43.78) v1(56.08,43.18) v1(56.08,42.58) v1(56.08,41.98) v1(56.08,41.38) v1(56.08,40.78) v1(56.08,40.18) v1(56.08,39.58) v1(56.08,32.98) v1(56.08,32.38) v1(56.08,31.78) v1(56.08,31.18) v1(56.08,30.58) v1(56.08,29.98) v1(56.08,29.38) v1(56.08,28.78) v1(56.08,28.18) v1(56.08,27.58) v1(56.08,26.98) v1(56.08,17.98) v1(56.08,17.38) v1(56.08,16.78) v1(56.08,16.18) v1(56.08,15.58) v1(56.08,14.98) v1(56.08,14.38) v1(56.08,13.78) v1(56.08,13.18) v1(56.08,12.58) v1(56.08,11.98) v1(56.08,11.38) v1(56.08,10.78) v1(56.08,10.18) v1(56.08,9.58) v1(56.08,8.98) v1(56.08,8.38) v1(56.08,7.78) v1(56.08,7.18) v1(56.08,6.58) v1(56.08,5.98) v1(56.08,5.38) v1(56.08,4.78) v1(56.08,4.18) v1(56.08,3.58) v1(56.08,2.98) v1(56.08,2.38)
